# EAGLE design AP==MIGOD (EAGLE 7.3.0)
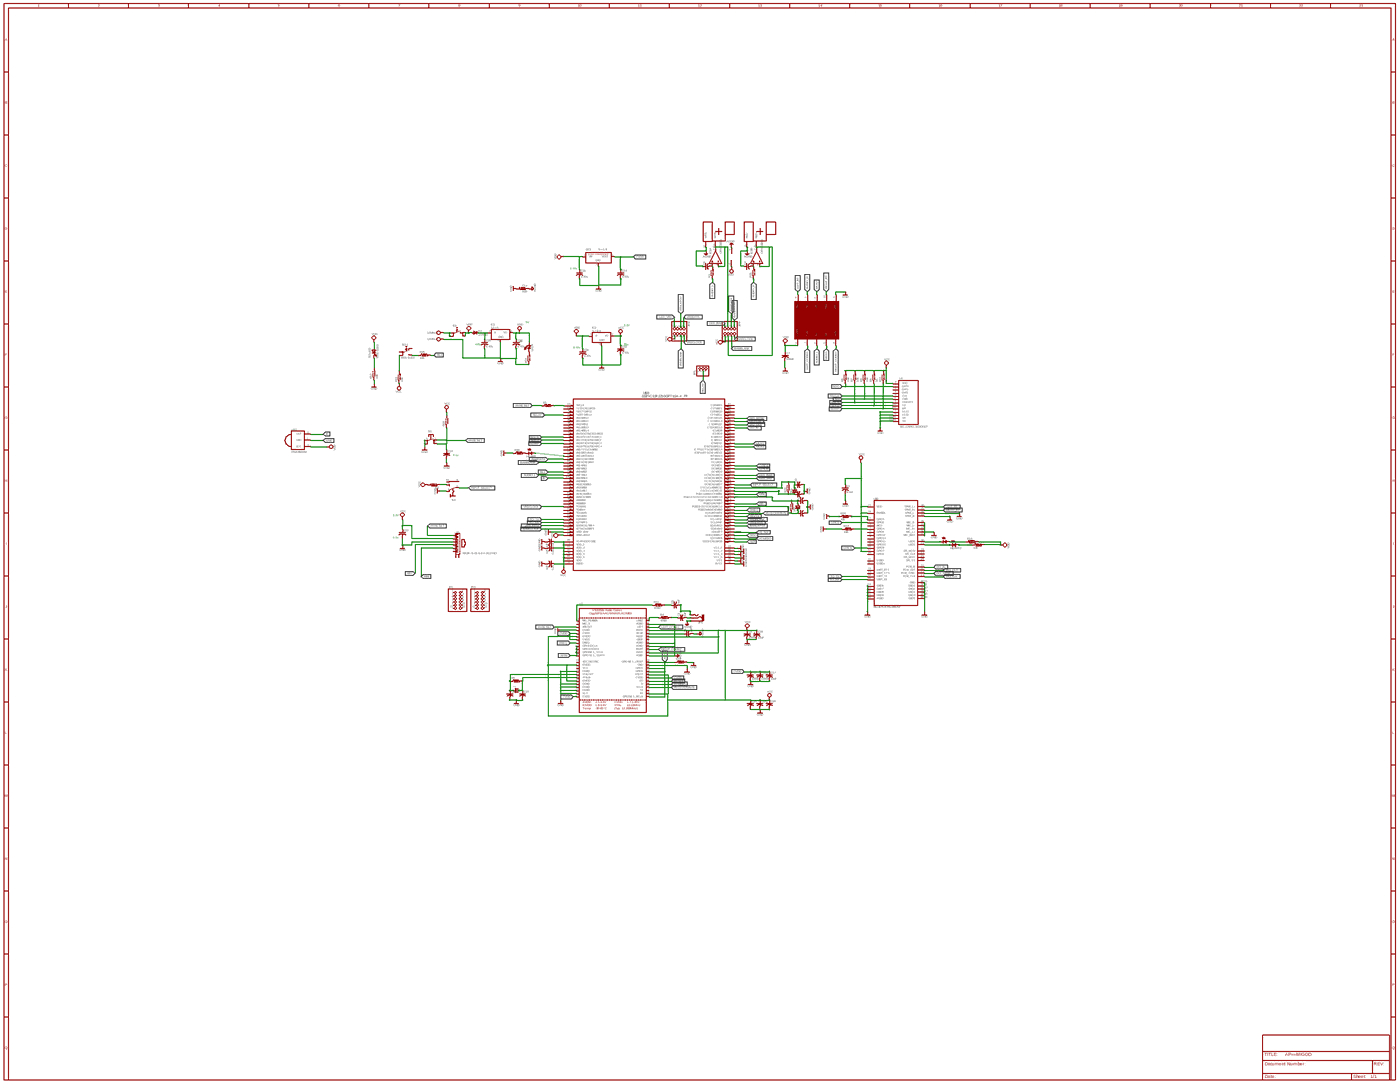
[diagram p0: schematic, sheet 1, overview]
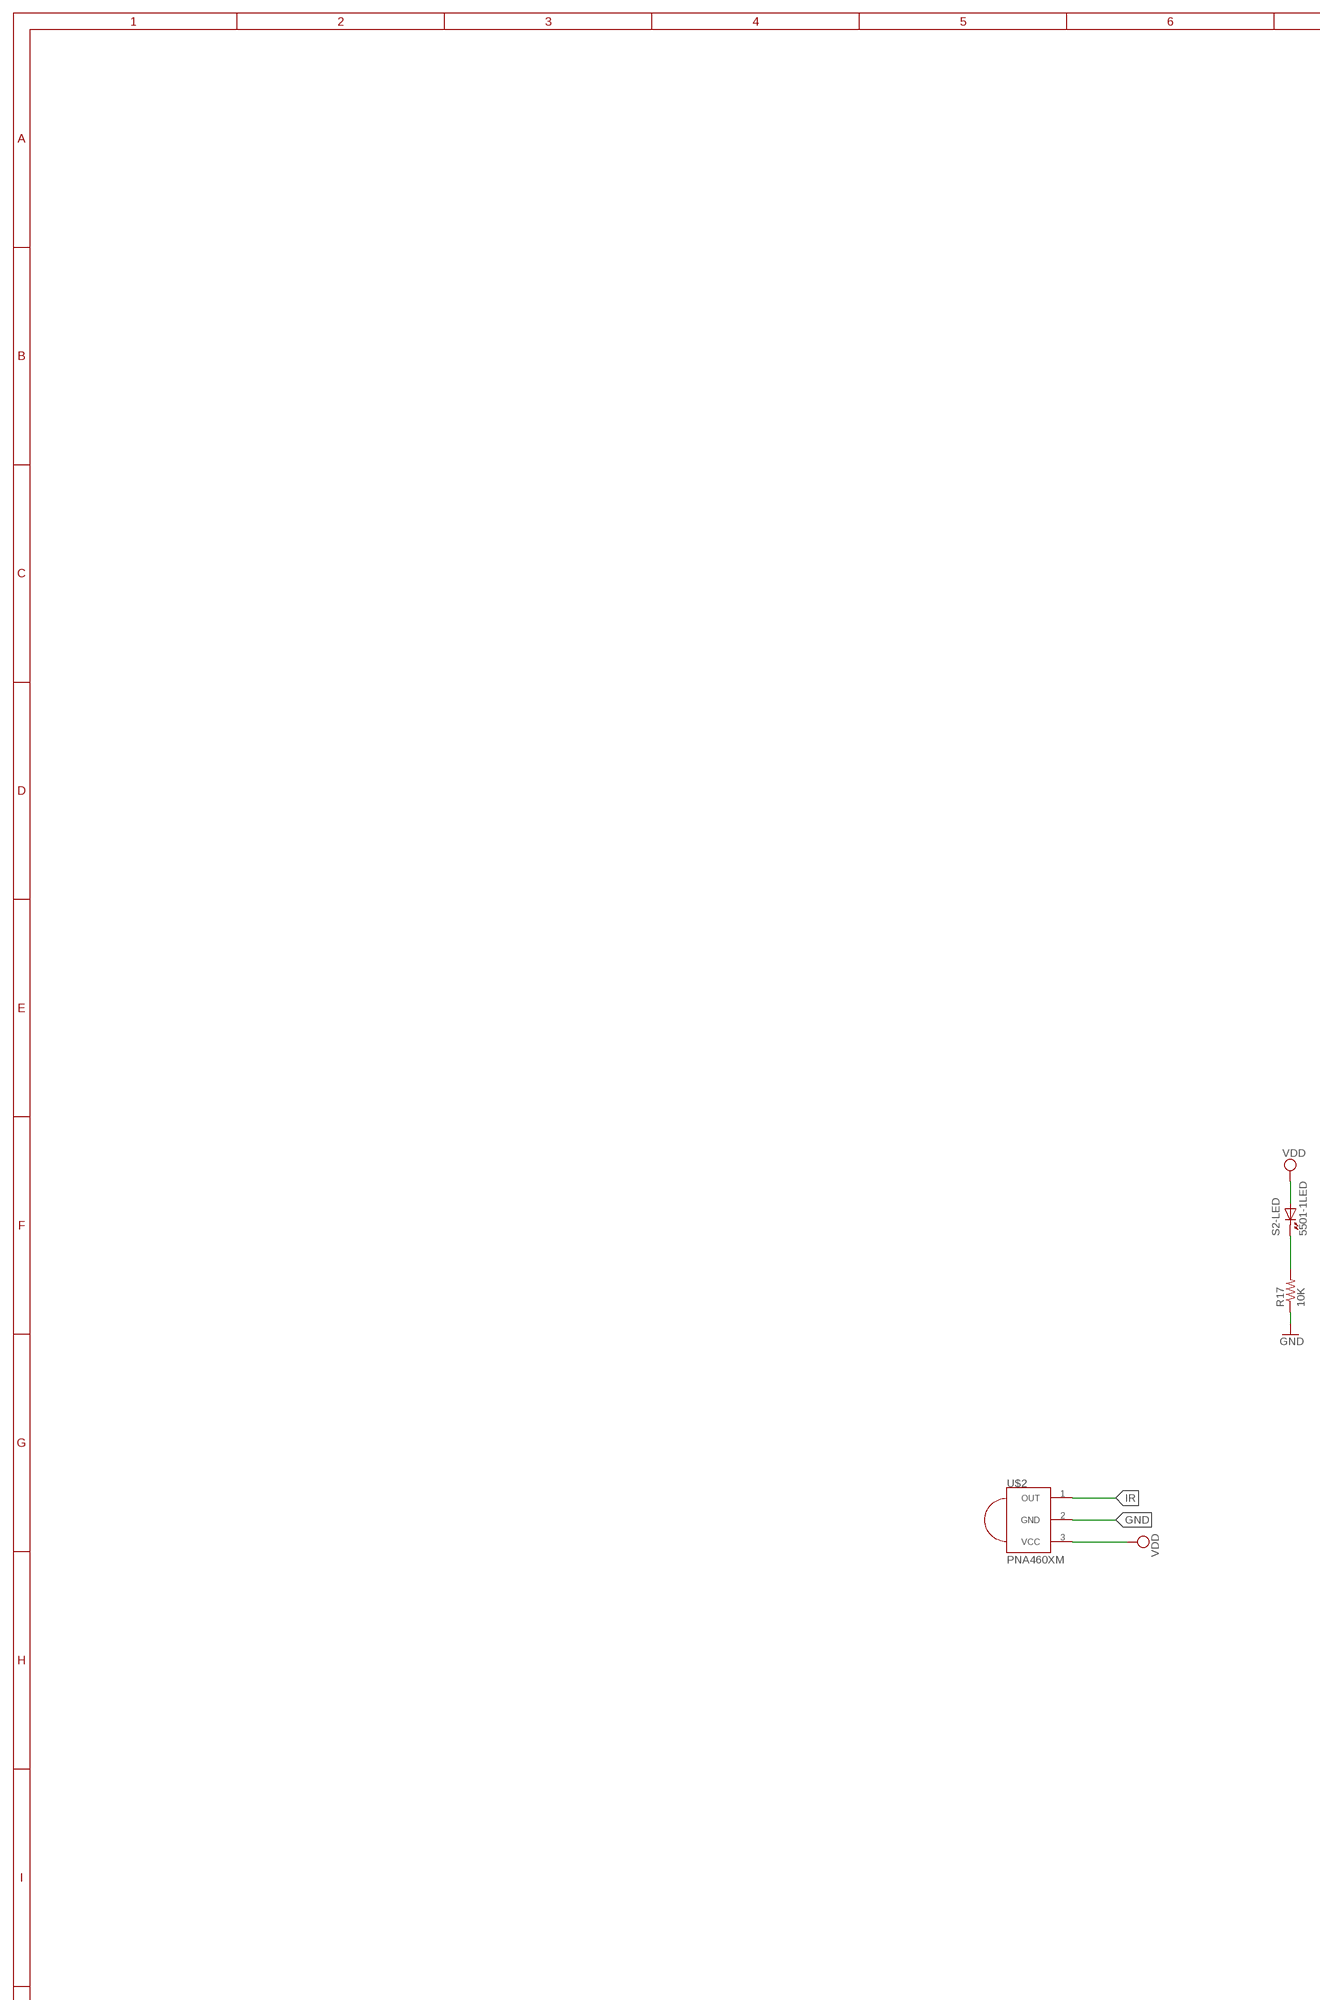
[diagram p1: schematic, sheet 1, part 1 of 6]
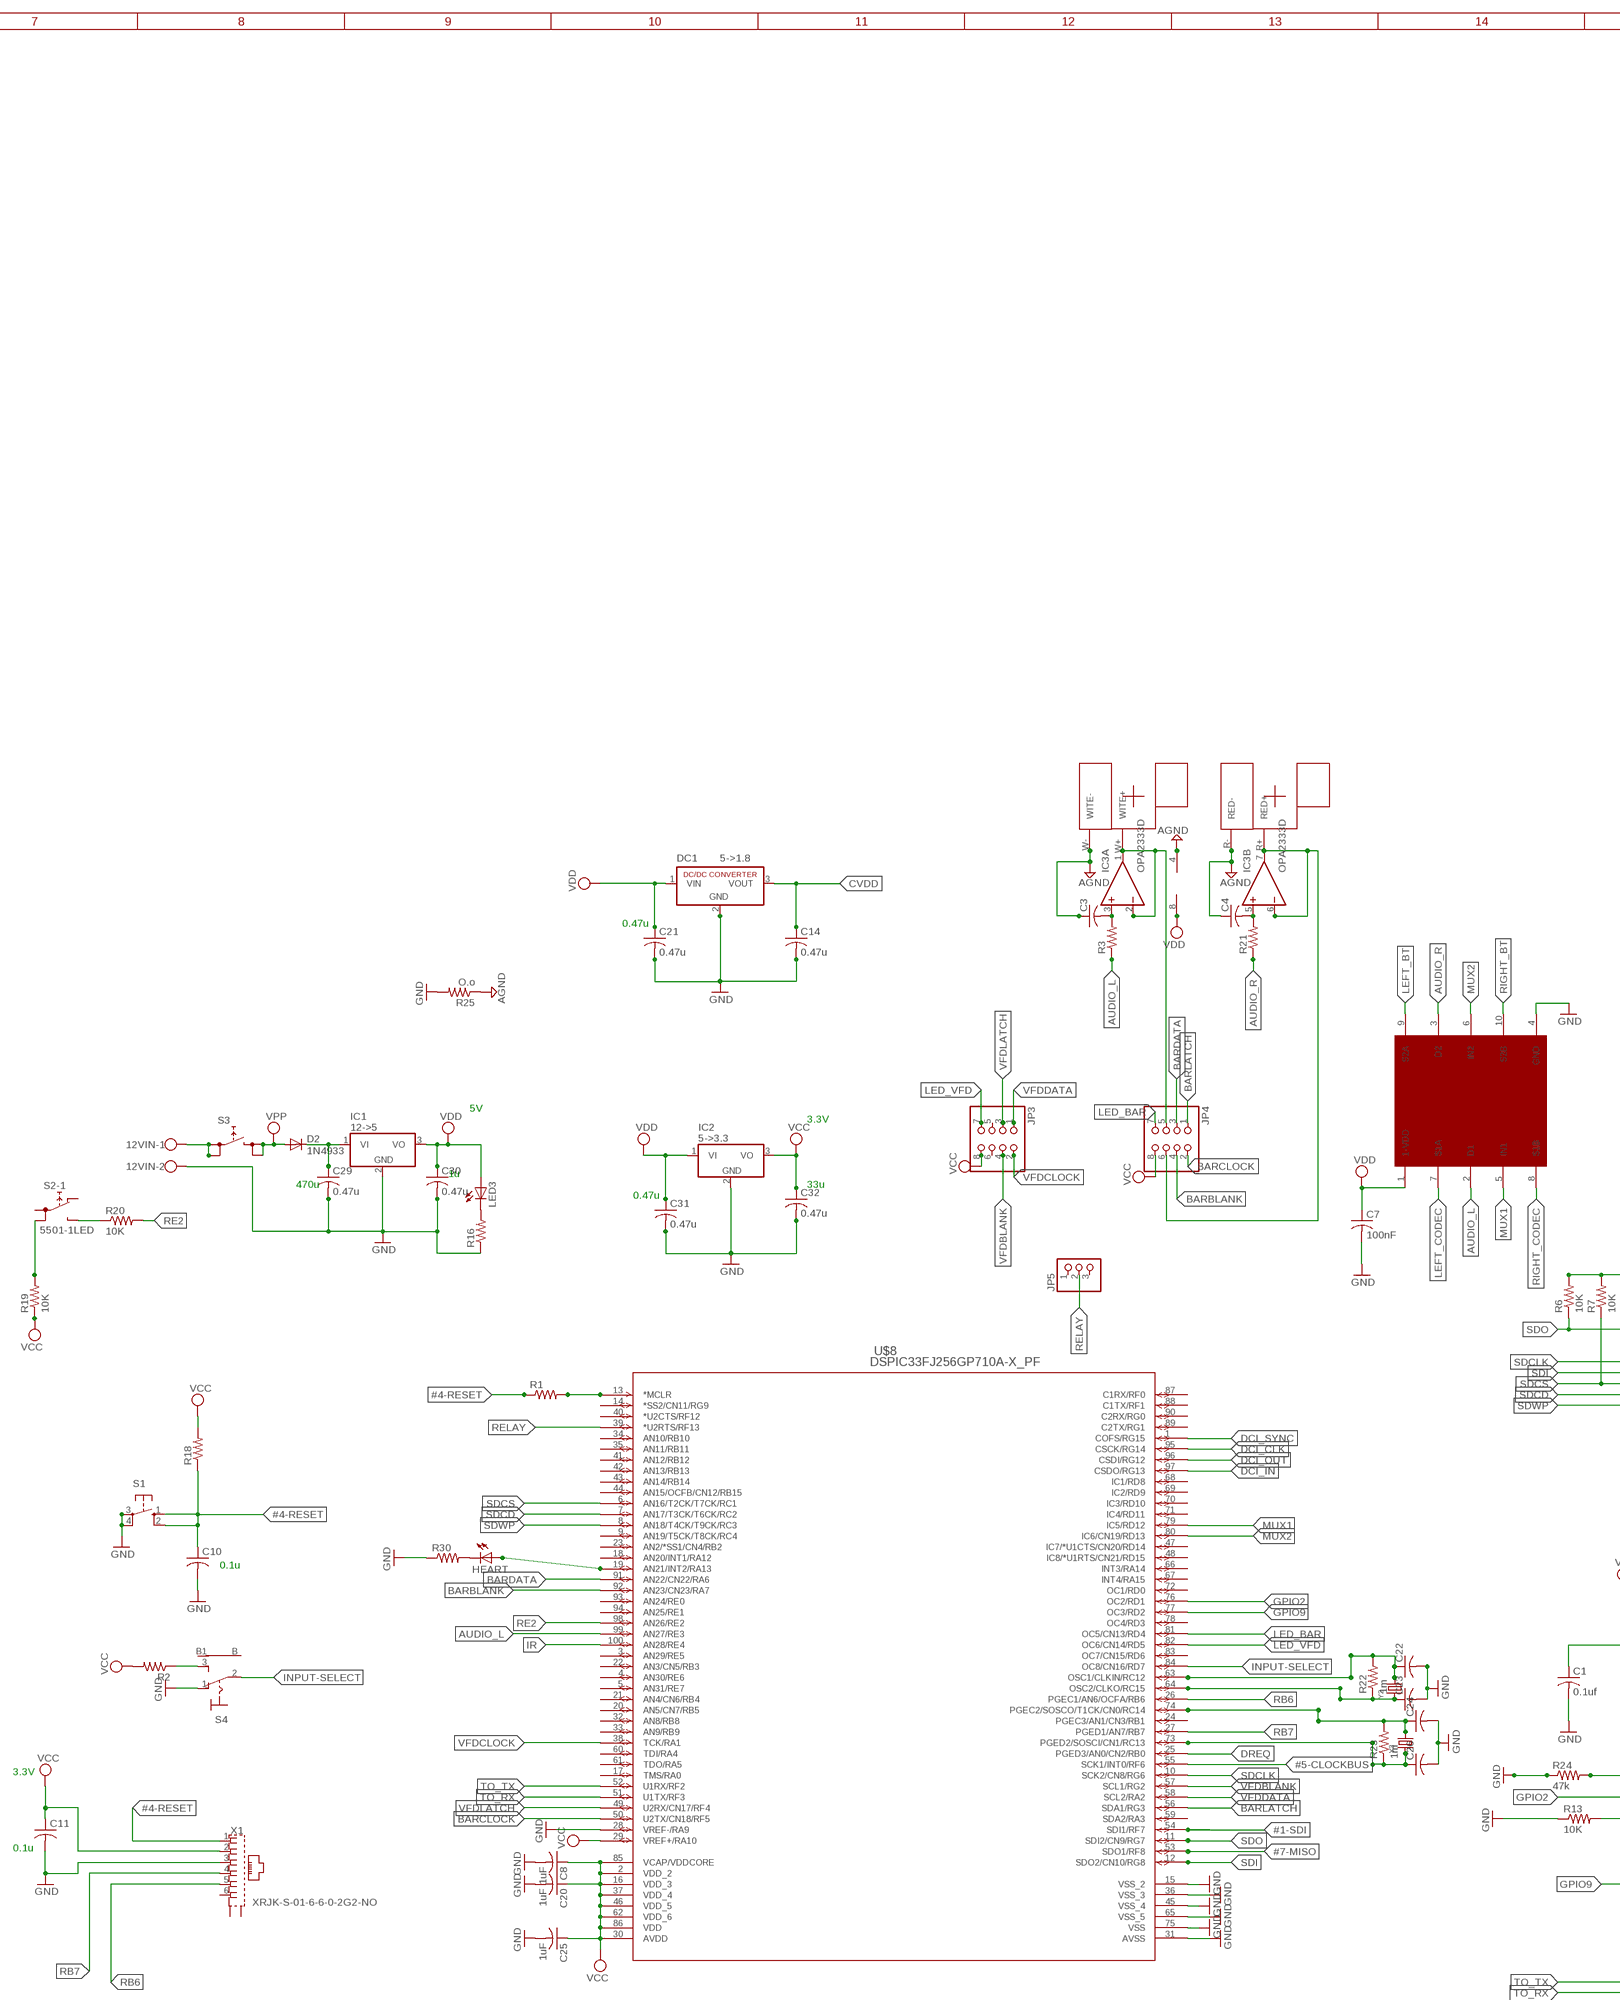
[diagram p2: schematic, sheet 1, part 2 of 6]
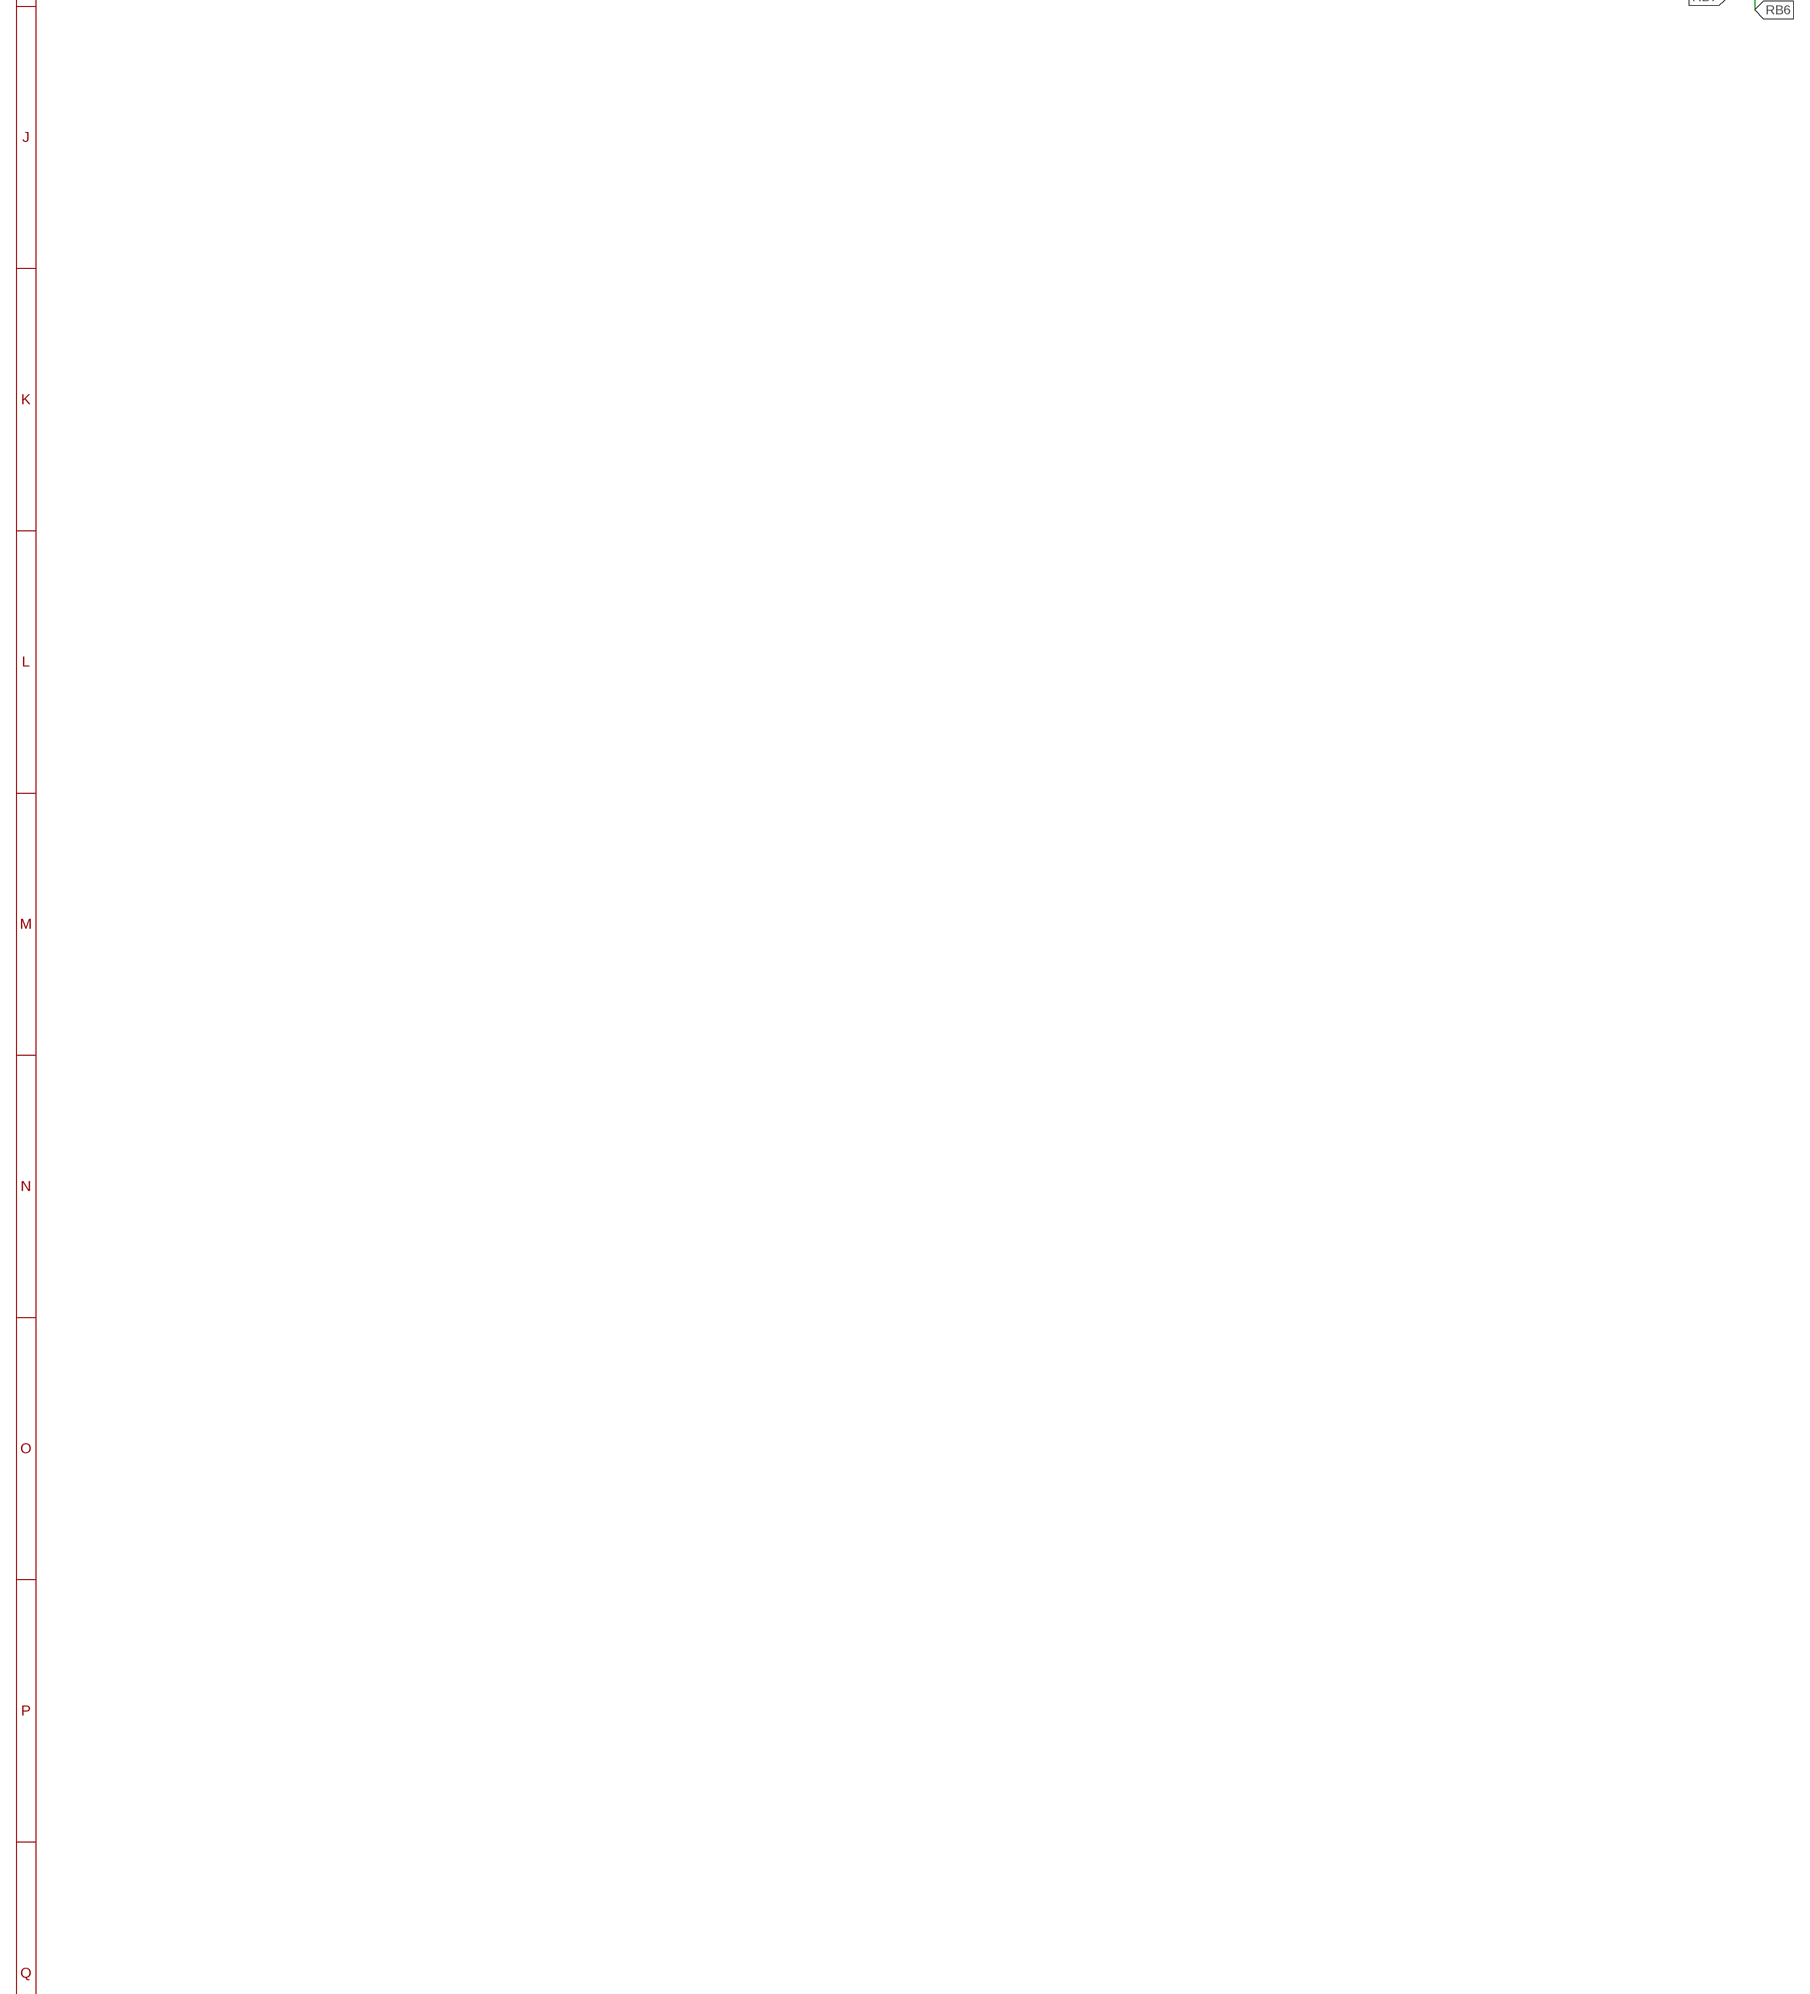
[diagram p3: schematic, sheet 1, part 3 of 6]
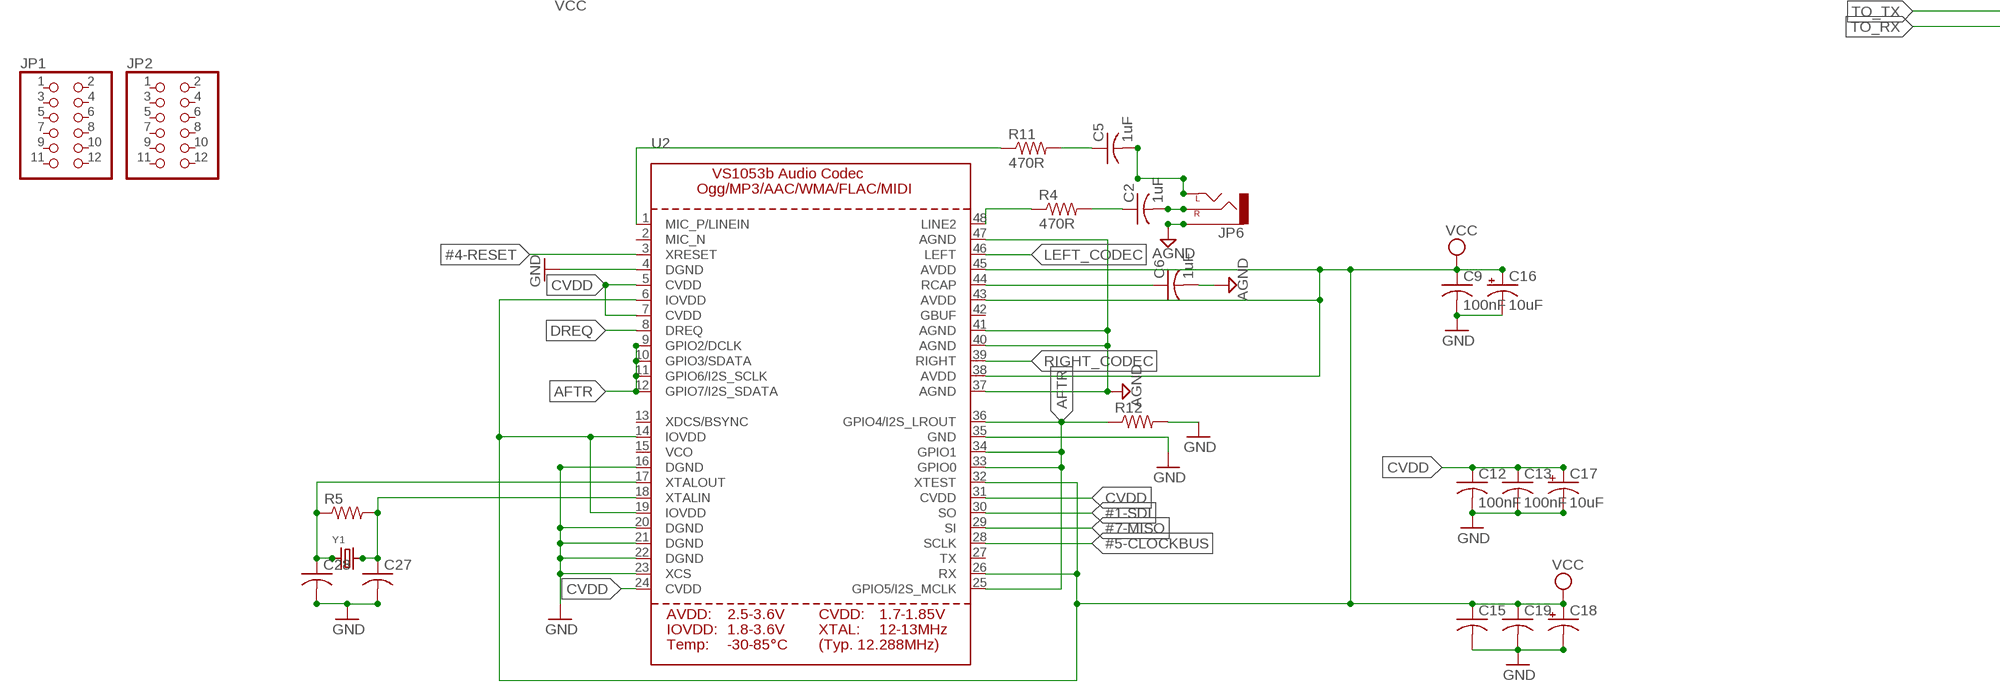
[diagram p4: schematic, sheet 1, part 4 of 6]
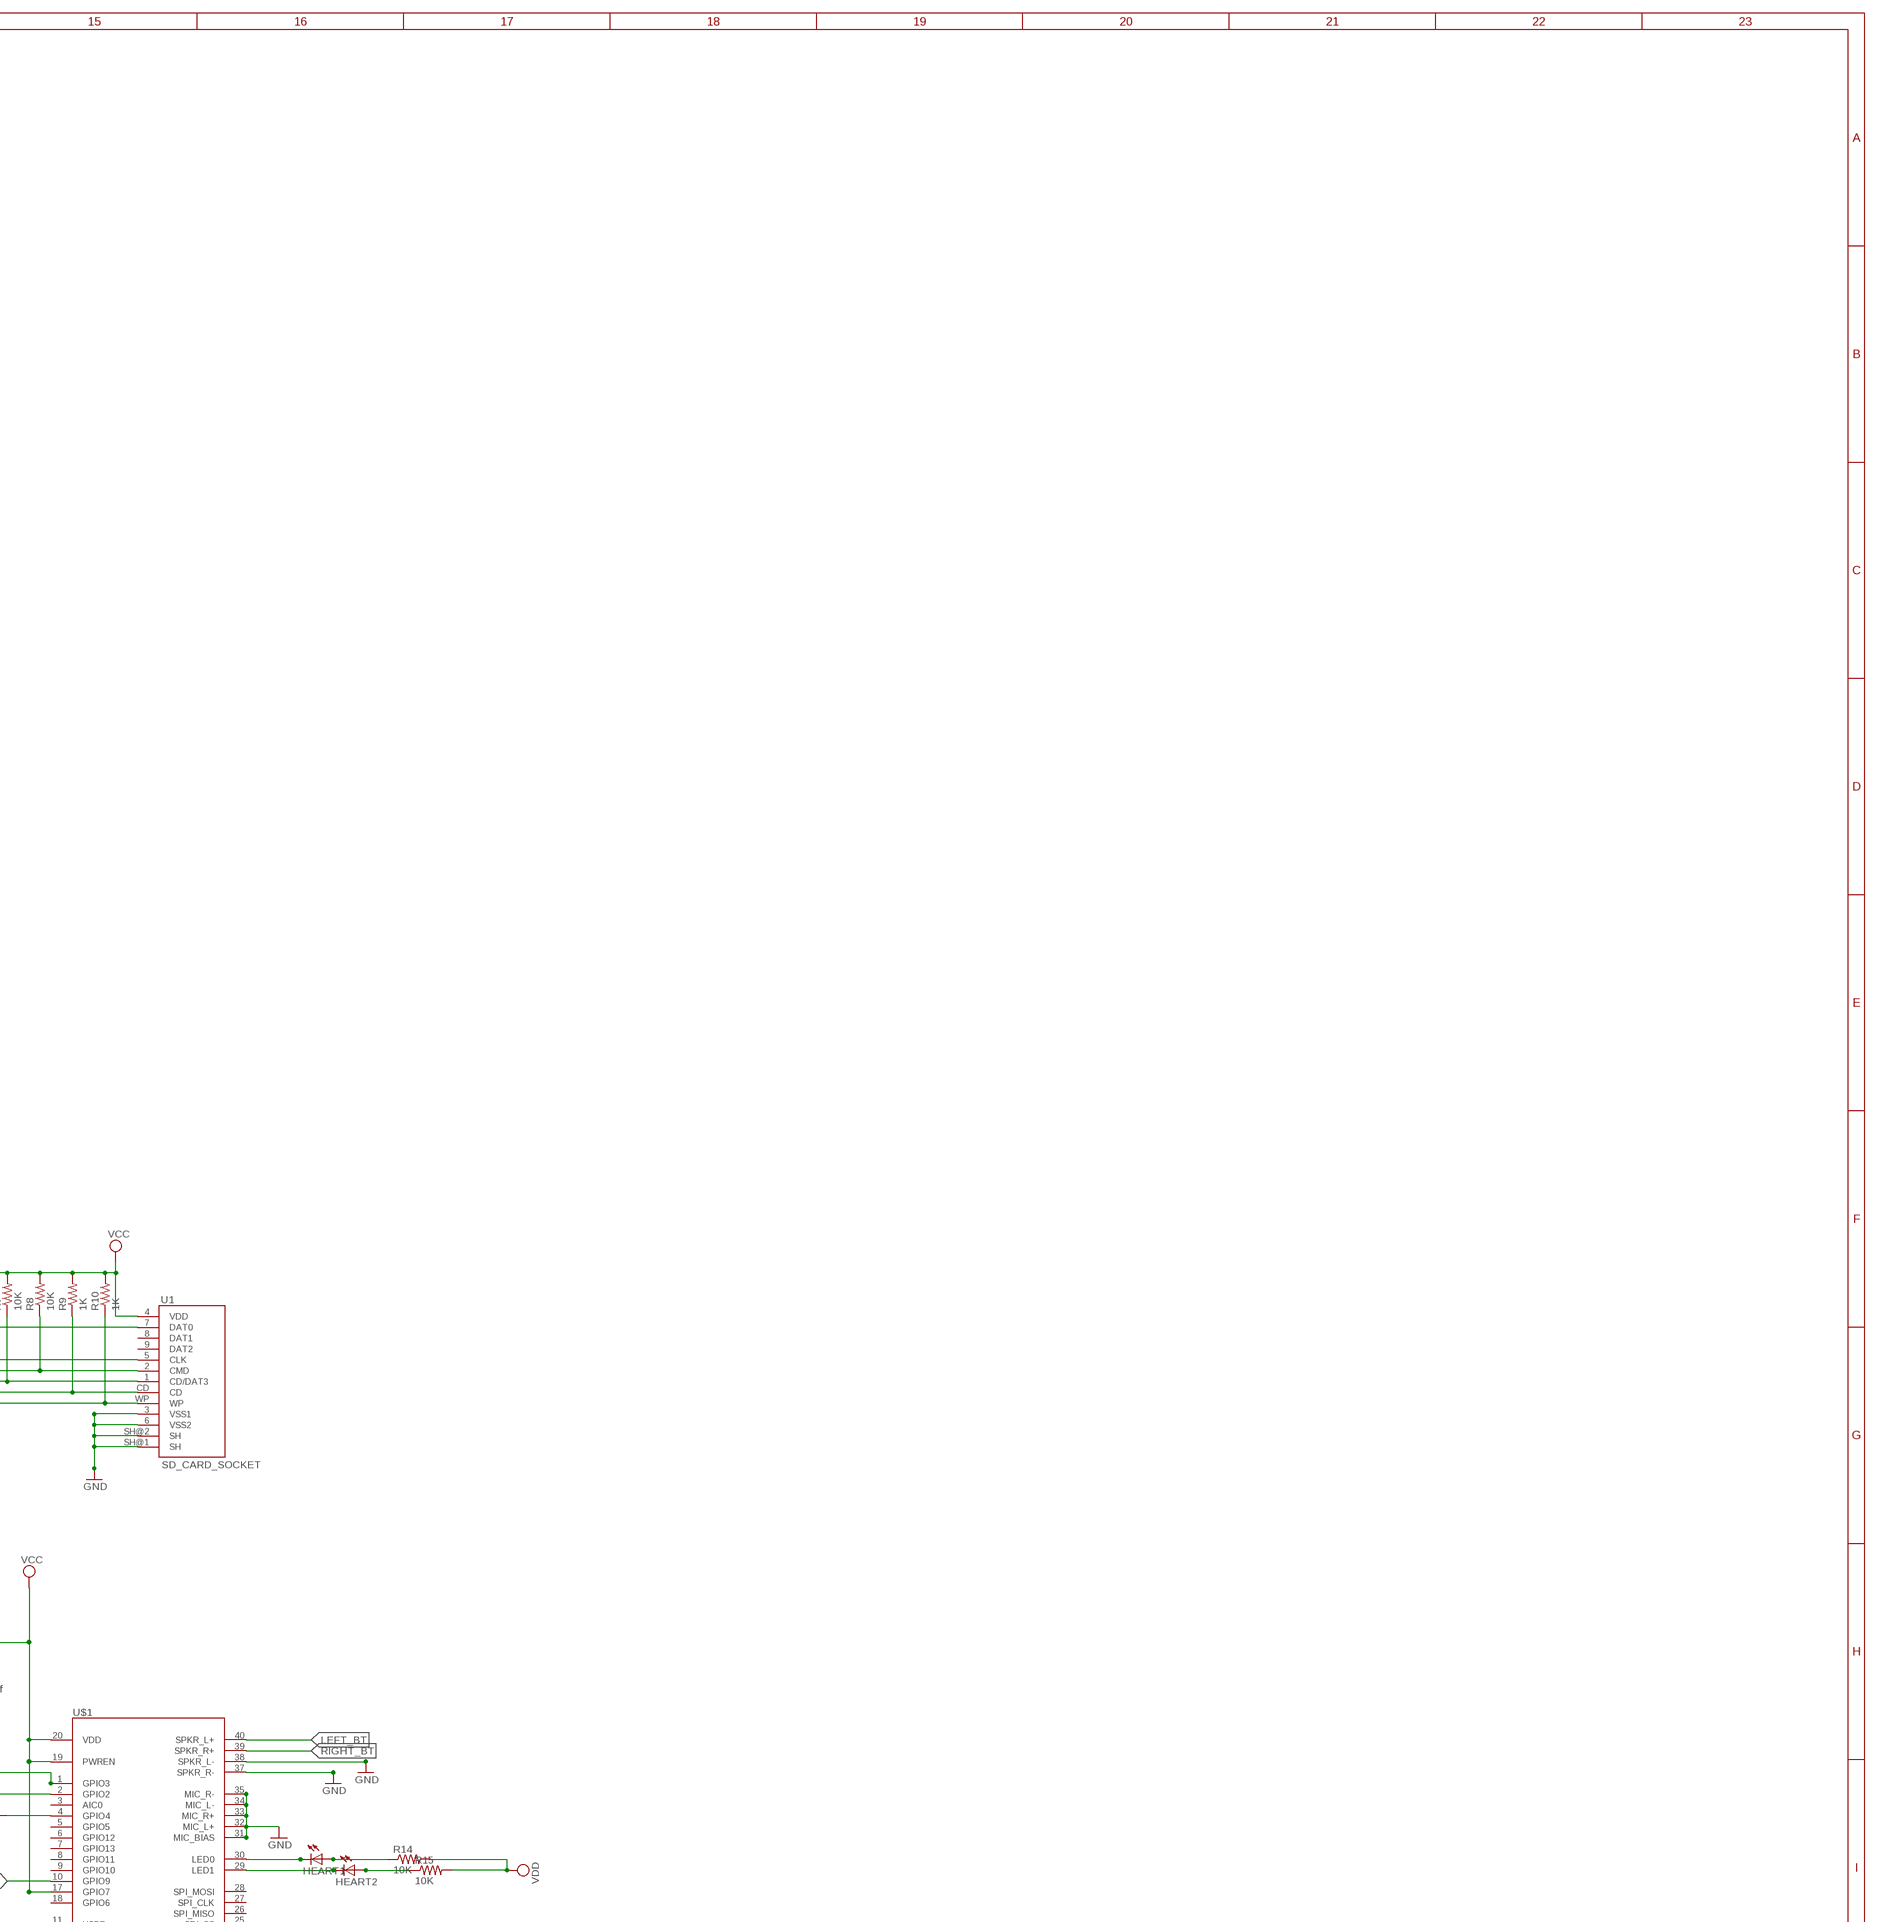
[diagram p5: schematic, sheet 1, part 5 of 6]
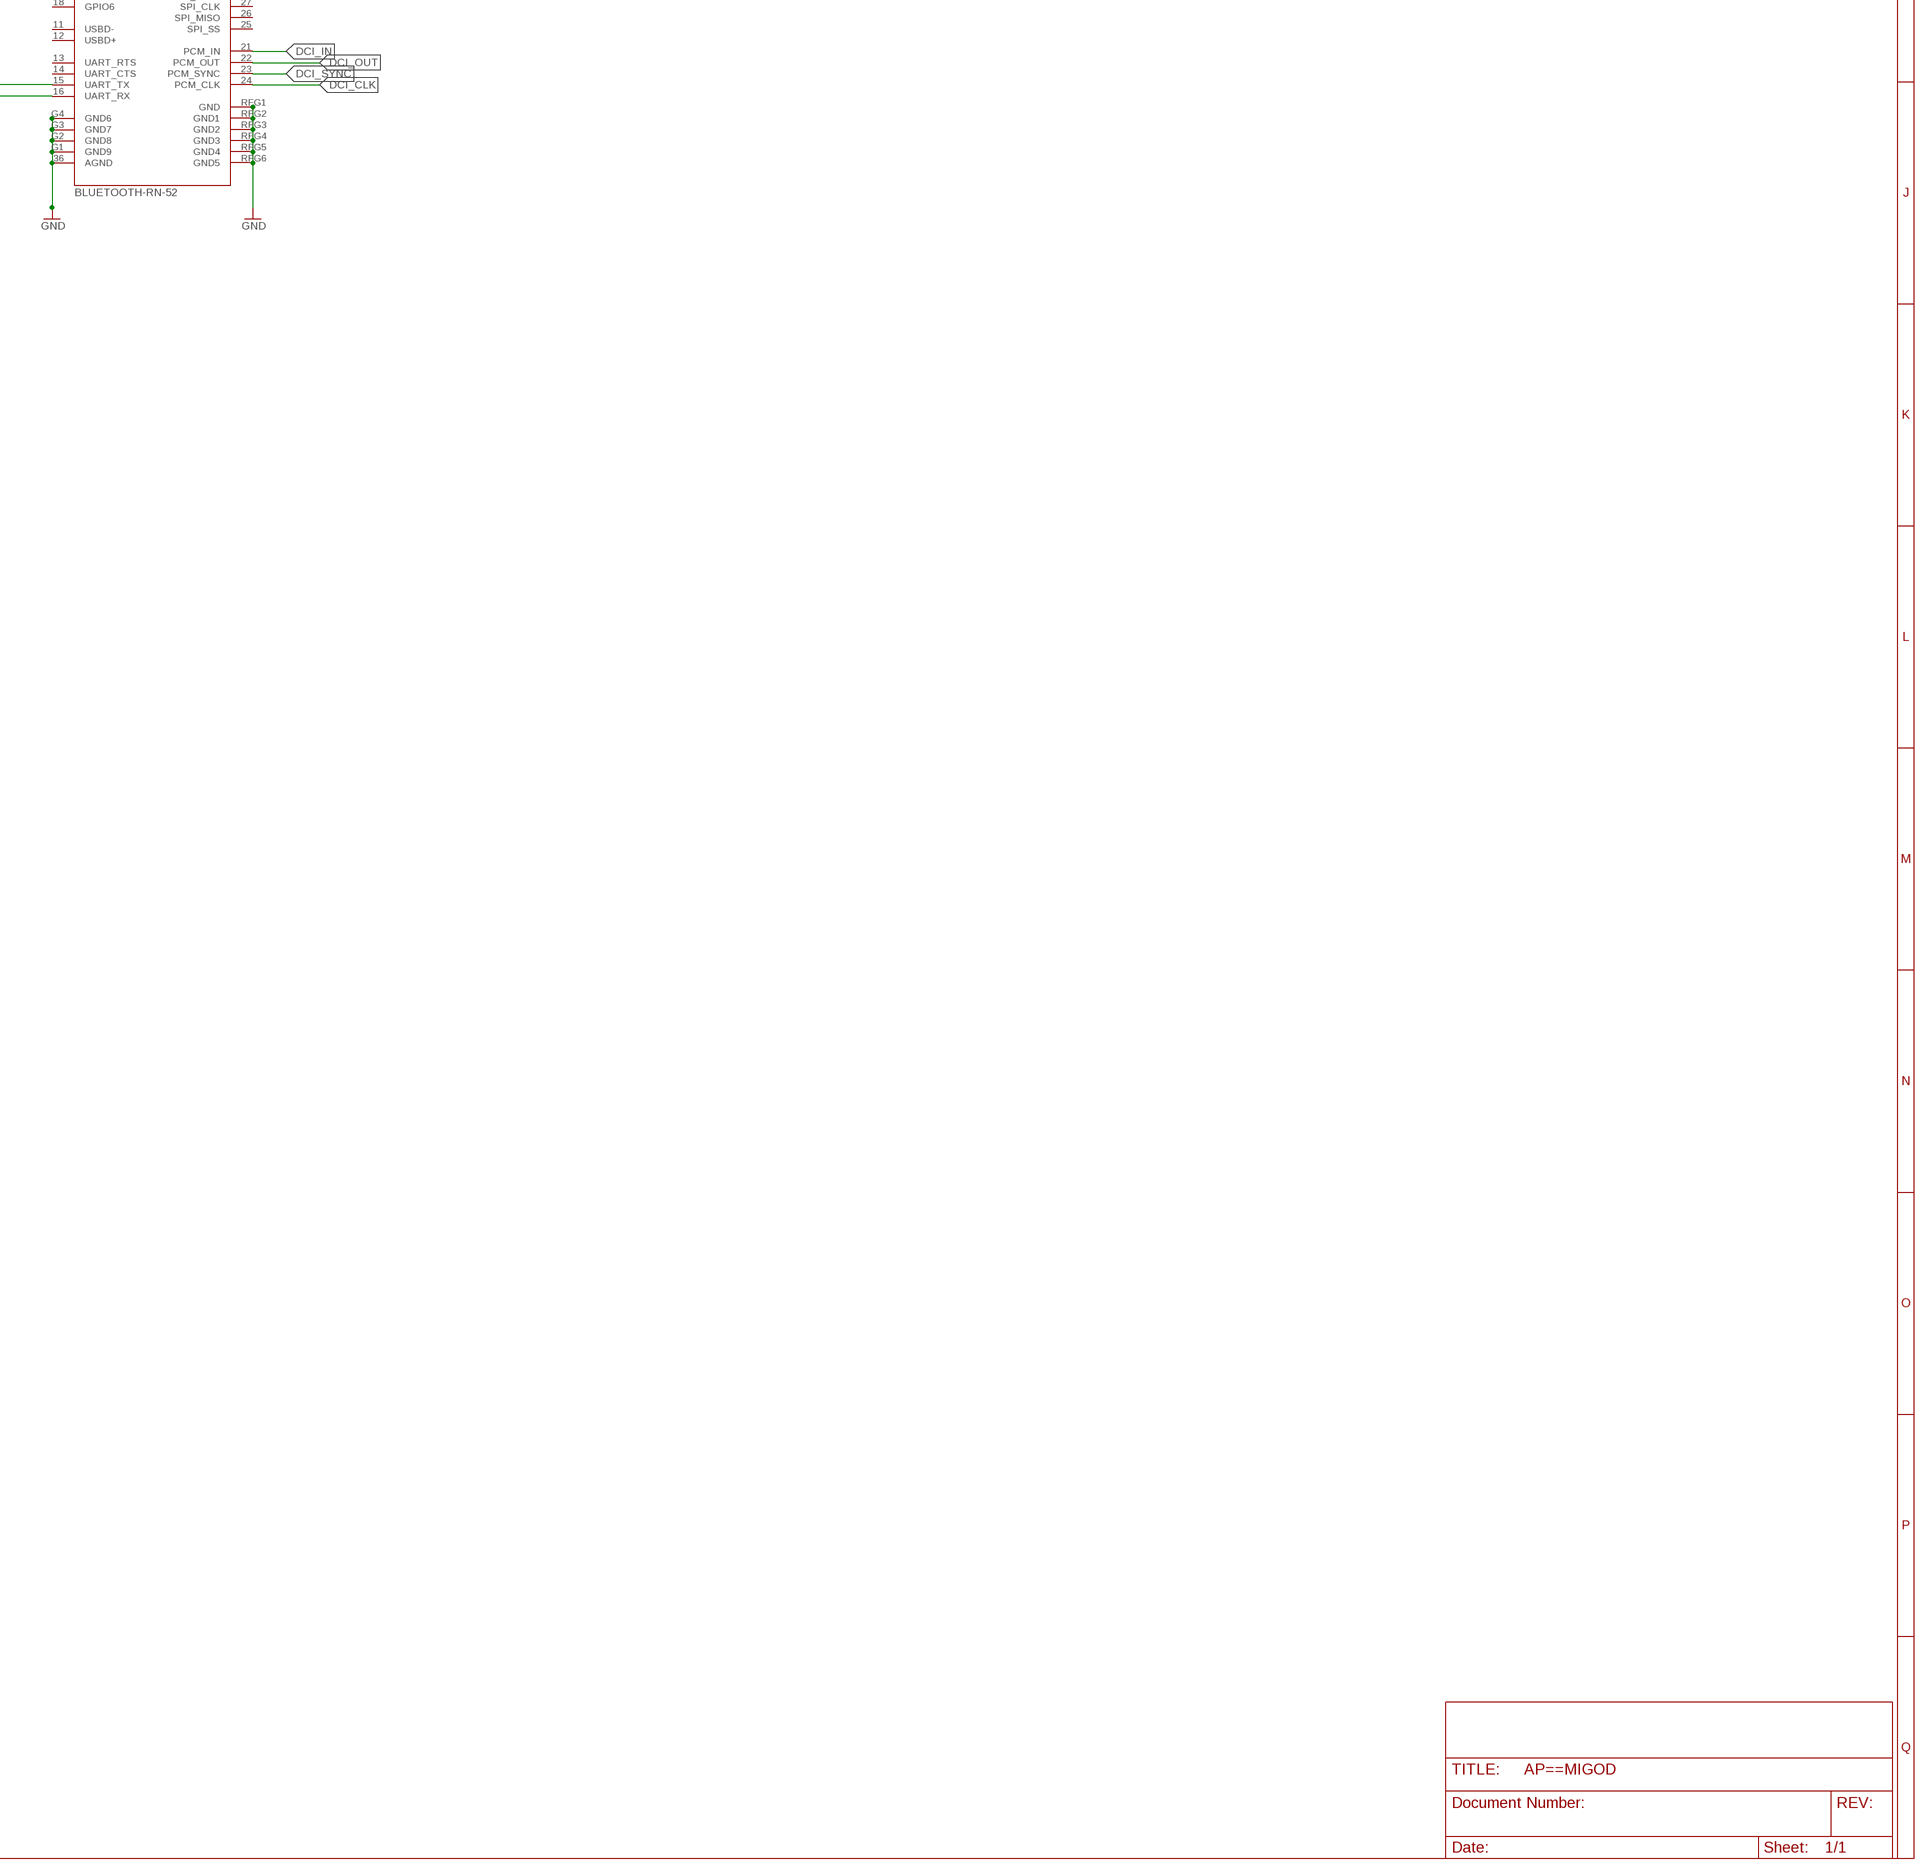
[diagram p6: schematic, sheet 1, part 6 of 6]

## Parts
12VIN  W237-102  [W237-102]
C1  0.1uf  C-USC1206  [C1206]
C2  1uF  C-USC1206  [C1206]
C3  C-US050-030X075  [C050-030X075]
C4  C-US050-030X075  [C050-030X075]
C5  1uF  C-USC1206  [C1206]
C6  1uF  C-USC1206  [C1206]
C7  100nF  C-USC1206  [C1206]
C8  1uF  C-USC1206  [C1206]
C9  100nF  C-USC1206  [C1206]
C10  C-USC1206  [C1206]
C11  C-USC1206  [C1206]
C12  100nF  C-USC1206  [C1206]
C13  100nF  C-USC1206  [C1206]
C14  0.47u  C-USC1206  [C1206]
C15  C-USC1206  [C1206]
C16  10uF  CPOL-USE5-8.5  [E5-8,5]
C17  10uF  CPOL-USE5-8.5  [E5-8,5]
C18  CPOL-USE5-8.5  [E5-8,5]
C19  C-USC1206  [C1206]
C20  1uF  C-USC1206  [C1206]
C21  0.47u  C-USC1206  [C1206]
C22  C-USC1206  [C1206]
C23  C-USC1206  [C1206]
C24  C-USC1206  [C1206]
C25  1uF  C-USC1206  [C1206]
C26  C-USC1206  [C1206]
C27  C-USC1206  [C1206]
C28  C-USC1206  [C1206]
C29  0.47u  C-USC1206  [C1206]
C30  0.47u  C-USC1206  [C1206]
C31  0.47u  C-USC1206  [C1206]
C32  0.47u  C-USC1206  [C1206]
D2  1N4933  [DO41-10]
DC1  5->1.8  R-78C1.8-1.0  [SIP3]
HEART  LEDSMT1206  [1206]
HEART1  LEDSMT1206  [1206]
HEART2  LEDSMT1206  [1206]
IC1  12->5  786TV  [TO220V]
IC2  5->3.3  786TV  [TO220V]
IC3  OPA2333D  [SO08]
JP1  PINHD-2X6  [2X06]
JP2  PINHD-2X6  [2X06]
JP3  PINHD-2X4  [2X04]
JP4  PINHD-2X4  [2X04]
JP5  PINHD-1X3  [1X03]
JP6  AUDIO-JACKPTH  [AUDIO-JACK]
LED3  LEDSMT1206  [1206]
R1  R-US_R1206  [R1206]
R2  R-US_R1206  [R1206]
R3  R-US_0207/10  [0207/10]
R4  470R  R-US_R1206  [R1206]
R5  R-US_R1206  [R1206]
R6  10K  R-US_R1206  [R1206]
R7  10K  R-US_R1206  [R1206]
R8  10K  R-US_R1206  [R1206]
R9  1K  R-US_R1206  [R1206]
R10  1K  R-US_R1206  [R1206]
R11  470R  R-US_R1206  [R1206]
R12  R-US_R1206  [R1206]
R13  10K  R-US_R1206  [R1206]
R14  10K  R-US_R1206  [R1206]
R15  10K  R-US_R1206  [R1206]
R16  R-US_R1206  [R1206]
R17  10K  R-US_R1206  [R1206]
R18  R-US_R1206  [R1206]
R19  10K  R-US_R1206  [R1206]
R20  10K  R-US_R1206  [R1206]
R21  R-US_0207/10  [0207/10]
R22  1m  R-US_R1206  [R1206]
R23  1m  R-US_R1206  [R1206]
R24  47k  R-US_R1206  [R1206]
R25  O.o  R-US_R1206  [R1206]
R30  R-US_R1206  [R1206]
S1  10-XX  [B3F-10XX]
S2  5501-1LED  [5501-1LED]
S3  REKN  [REKN]
S4  9070-1W  [9070-1W]
U1  SD_CARD_SOCKET  [SD_1:1]
U2  VS1053B  [LQFP48]
U$1  BLUETOOTH-RN-52  [RN-52]
U$2  PNA460XM  [PNA460XM]
U$8  DSPIC33FJ256GP710A-X_PF  [TQFP100_14X14MC]
U$13  RCANEW  [RCA]
U$15  ADG884  [MSOP10]
X1  XRJK-S-01-6-6-0-2G2-NO  [XRJK-S-01-6-6-0-2G2-NO]
Y1  CRYSTALTHIN  [CRYSTAL_3.2X2.5]
Y2  CRYSTALTHIN  [CRYSTAL_3.2X2.5]
Y3  CRYSTALTHIN  [CRYSTAL_3.2X2.5]

## Nets
#1-SDI: U2.30(SO) U$8.54(SDI1/RF7)
#4-RESET: C10.1 R1.1 R18.1 S1.1(S) S1.2(S1) U2.3(XRESET) X1.1
#5-CLOCKBUS: U2.28(SCLK) U$8.55(SCK1/INT0/RF6)
#7-MISO: U2.29(SI) U$8.53(SDO1/RF8)
AFTR: R12.1 U2.9(GPIO2/DCLK) U2.10(GPIO3/SDATA) U2.11(GPIO6/I2S_SCLK) U2.12(GPIO7/I2S_SDATA) U2.25(GPIO5/I2S_MCLK) U2.33(GPIO0) U2.34(GPIO1) U2.36(GPIO4/I2S_LROUT)
AGND: C3.1 C4.1 C6.2 IC3.4(P:V-) JP6.SLEEVE R25.1 U2.37(AGND) U2.40(AGND) U2.41(AGND) U2.47(AGND) U$13.R-(RED-) U$13.W-(WITE-)
AUDIO_L: R3.1 U$8.99(AN27/RE3) U$15.2(D1)
AUDIO_R: R21.1 U$15.3(D2)
BARBLANK: JP4.4 U$8.92(AN23/CN23/RA7)
BARCLOCK: JP4.2 U$8.50(U2TX/CN18/RF5)
BARDATA: JP4.3 U$8.91(AN22/CN22/RA6)
BARLATCH: JP4.1 U$8.56(SDA1/RG3)
CVDD: C12.1 C13.1 C14.1 C17.+ DC1.3(VOUT) U2.5(CVDD) U2.7(CVDD) U2.24(CVDD) U2.31(CVDD)
DCI_CLK: U$1.24(PCM_CLK) U$8.95(CSCK/RG14)
DCI_IN: U$1.21(PCM_IN) U$8.97(CSDO/RG13)
DCI_OUT: U$1.22(PCM_OUT) U$8.96(CSDI/RG12)
DCI_SYNC: U$1.23(PCM_SYNC) U$8.1(COFS/RG15)
DREQ: U2.8(DREQ) U$8.25(PGED3/AN0/CN2/RB0)
GND: 12VIN.2 C1.2 C7.2 C8.2 C9.2 C10.2 C11.2 C12.2 C13.2 C14.2 C15.2 C16.- C17.- C18.- C19.2 C20.2 C21.2 C22.2 C23.2 C24.2 C25.2 C26.2 C27.2 C28.2 C29.2 C30.2 C31.2 C32.2 DC1.2(GND) IC1.2(GND) IC2.2(GND) R12.2 R13.1 R16.1 R17.1 R24.1 R25.2 R30.1 S1.3(P) S1.4(P1) S4.1(O) U1.3(VSS1) U1.6(VSS2) U1.SH@1(SH) U1.SH@2(SH) U2.4(DGND) U2.16(DGND) U2.20(DGND) U2.21(DGND) U2.22(DGND) U2.23(XCS) U2.35(GND) U$1.31(MIC_BIAS) U$1.32(MIC_L+) U$1.33(MIC_R+) U$1.34(MIC_L-) U$1.35(MIC_R-) U$1.36(AGND) U$1.37(SPKR_R-) U$1.38(SPKR_L-) U$1.G1(GND9) U$1.G2(GND8) U$1.G3(GND7) U$1.G4(GND6) U$1.RFG1(GND) U$1.RFG2(GND1) U$1.RFG3(GND2) U$1.RFG4(GND3) U$1.RFG5(GND4) U$1.RFG6(GND5) U$2.2(GND) U$8.15(VSS_2) U$8.28(VREF-/RA9) U$8.31(AVSS) U$8.36(VSS_3) U$8.45(VSS_4) U$8.65(VSS_5) U$8.75(VSS) U$15.4(GND) X1.3
GPIO2: U$1.2(GPIO2) U$8.76(OC2/RD1)
GPIO9: U$1.10(GPIO9) U$8.77(OC3/RD2)
INPUT-SELECT: S4.2(P) U$8.84(OC8/CN16/RD7)
IR: U$2.1(OUT) U$8.100(AN28/RE4)
LED_BAR: JP4.7 U$8.81(OC5/CN13/RD4)
LED_VFD: JP3.7 U$8.82(OC6/CN14/RD5)
LEFT_BT: U$1.40(SPKR_L+) U$15.9(S2A)
LEFT_CODEC: U2.46(LEFT) U$15.7(S1A)
MUX1: U$8.79(IC5/RD12) U$15.5(IN1)
MUX2: U$8.80(IC6/CN19/RD13) U$15.6(IN2)
N$1: C2.2 JP6.RING(RIGHT)
N$2: R1.2 U$8.13(*MCLR)
N$3: LED3.C R16.2
N$4: C6.1 U2.44(RCAP)
N$5: R19.2 S2.1B(-1:1B)
N$9: C28.1 R5.1 U2.17(XTALOUT) Y1.1
N$12: C27.1 R5.2 U2.18(XTALIN) Y1.2
N$13: C2.1 R4.2
N$14: R4.1 U2.48(LINE2)
N$15: C5.2 JP6.TIP(LEFT)
N$16: C5.1 R11.2
N$17: R11.1 U2.1(MIC_P/LINEIN)
N$19: C24.1 R23.2 U$8.74(PGEC2/SOSCO/T1CK/CN0/RC14) Y3.2
N$20: R13.2 U$1.4(GPIO4)
N$22: C29.1 D2.C IC1.1(VI)
N$23: HEART1.C U$1.30(LED0)
N$24: HEART2.C U$1.29(LED1)
N$25: HEART1.A R14.1
N$26: HEART2.A R15.1
N$27: C22.1 R22.2 U$8.63(OSC1/CLKIN/RC12) Y2.2
N$28: IC3.1(A:OUT) IC3.2(A:-IN) JP4.5 U$13.W+(WITE+)
N$29: IC3.6(B:-IN) IC3.7(B:OUT) JP4.6 U$13.R+(RED+)
N$30: C3.2 IC3.3(A:+IN) R3.2
N$31: R17.2 S2.-(-LED:K)
N$32: R20.1 S2.NO(-1:NO)
N$33: 12VIN.1 S3.0A S3.0B
N$34: C4.2 IC3.5(B:+IN) R21.2
N$35: R2.1 S4.3(S)
N$36: R24.2 U$1.1(GPIO3)
N$37: C23.1 R22.1 U$8.64(OSC2/CLKO/RC15) Y2.1
N$78: C26.1 R23.1 U$8.73(PGED2/SOSCI/CN1/RC13) Y3.1
N$97: HEART.A U$8.19(AN21/INT2/RA13)
N$98: HEART.C R30.2
RB6: U$8.26(PGEC1/AN6/OCFA/RB6) X1.5
RB7: U$8.27(PGED1/AN7/RB7) X1.4
RE2: R20.2 U$8.98(AN26/RE2)
RELAY: JP5.2 U$8.39(*U2RTS/RF13)
RIGHT_BT: U$1.39(SPKR_R+) U$15.10(S2B)
RIGHT_CODEC: U2.39(RIGHT) U$15.8(S1B)
SDCD: R9.1 U1.CD U$8.7(AN17/T3CK/T6CK/RC2)
SDCLK: U1.5(CLK) U$8.10(SCK2/CN8/RG6)
SDCS: R7.1 U1.1(CD/DAT3) U$8.6(AN16/T2CK/T7CK/RC1)
SDI: R8.1 U1.2(CMD) U$8.12(SDO2/CN10/RG8)
SDO: R6.1 U1.7(DAT0) U$8.11(SDI2/CN9/RG7)
SDWP: R10.1 U1.WP U$8.8(AN18/T4CK/T9CK/RC3)
TO_RX: U$1.16(UART_RX) U$8.51(U1TX/RF3)
TO_TX: U$1.15(UART_TX) U$8.52(U1RX/RF2)
VCC: C1.1 C8.1 C9.1 C11.1 C15.1 C16.+ C18.+ C19.1 C20.1 C25.1 C32.1 IC2.3(VO) JP3.8 JP4.8 R2.2 R6.2 R7.2 R8.2 R9.2 R10.2 R18.2 R19.1 U1.4(VDD) U2.6(IOVDD) U2.14(IOVDD) U2.19(IOVDD) U2.26(RX) U2.32(XTEST) U2.38(AVDD) U2.43(AVDD) U2.45(AVDD) U$1.17(GPIO7) U$1.19(PWREN) U$1.20(VDD) U$8.2(VDD_2) U$8.16(VDD_3) U$8.29(VREF+/RA10) U$8.30(AVDD) U$8.37(VDD_4) U$8.46(VDD_5) U$8.62(VDD_6) U$8.85(VCAP/VDDCORE) U$8.86(VDD) X1.2
VDD: C7.1 C21.1 C30.1 C31.1 DC1.1(VIN) IC1.3(VO) IC2.1(VI) IC3.8(P:V+) LED3.A R14.2 R15.2 S2.+(-LED:A) U$2.3(VCC) U$15.1(1-VDD)
VFDBLANK: JP3.4 U$8.57(SCL1/RG2)
VFDCLOCK: JP3.2 U$8.38(TCK/RA1)
VFDDATA: JP3.1 U$8.58(SCL2/RA2)
VFDLATCH: JP3.3 U$8.49(U2RX/CN17/RF4)
VPP: D2.A S3.1A S3.1B
Unconnected: JP1.1 JP1.2 JP1.3 JP1.4 JP1.5 JP1.6 JP1.7 JP1.8 JP1.9 JP1.10 JP1.11 JP1.12 JP2.1 JP2.2 JP2.3 JP2.4 JP2.5 JP2.6 JP2.7 JP2.8 JP2.9 JP2.10 JP2.11 JP2.12 JP3.5 JP3.6 JP5.1 JP5.3 S2.1A(-1:1A) S2.NC(-1:NC) S4.B S4.B1 U1.8(DAT1) U1.9(DAT2) U2.2(MIC_N) U2.13(XDCS/BSYNC) U2.15(VCO) U2.27(TX) U2.42(GBUF) U$1.3(AIC0) U$1.5(GPIO5) U$1.6(GPIO12) U$1.7(GPIO13) U$1.8(GPIO11) U$1.9(GPIO10) U$1.11(USBD-) U$1.12(USBD+) U$1.13(UART_RTS) U$1.14(UART_CTS) U$1.18(GPIO6) U$1.25(SPI_SS) U$1.26(SPI_MISO) U$1.27(SPI_CLK) U$1.28(SPI_MOSI) U$8.3(AN29/RE5) U$8.4(AN30/RE6) U$8.5(AN31/RE7) U$8.9(AN19/T5CK/T8CK/RC4) U$8.14(*SS2/CN11/RG9) U$8.17(TMS/RA0) U$8.18(AN20/INT1/RA12) U$8.20(AN5/CN7/RB5) U$8.21(AN4/CN6/RB4) U$8.22(AN3/CN5/RB3) U$8.23(AN2/*SS1/CN4/RB2) U$8.24(PGEC3/AN1/CN3/RB1) U$8.32(AN8/RB8) U$8.33(AN9/RB9) U$8.34(AN10/RB10) U$8.35(AN11/RB11) U$8.40(*U2CTS/RF12) U$8.41(AN12/RB12) U$8.42(AN13/RB13) U$8.43(AN14/RB14) U$8.44(AN15/OCFB/CN12/RB15) U$8.47(IC7/*U1CTS/CN20/RD14) U$8.48(IC8/*U1RTS/CN21/RD15) U$8.59(SDA2/RA3) U$8.60(TDI/RA4) U$8.61(TDO/RA5) U$8.66(INT3/RA14) U$8.67(INT4/RA15) U$8.68(IC1/RD8) U$8.69(IC2/RD9) U$8.70(IC3/RD10) U$8.71(IC4/RD11) U$8.72(OC1/RD0) U$8.78(OC4/RD3) U$8.83(OC7/CN15/RD6) U$8.87(C1RX/RF0) U$8.88(C1TX/RF1) U$8.89(C2TX/RG1) U$8.90(C2RX/RG0) U$8.93(AN24/RE0) U$8.94(AN25/RE1) X1.6 X1.S1(S) X1.S2(S)

## Notes on the sheet
- 0.47u
- 5V
- 3.3V
- 1u
- 470u | 33u
- 0.47u
- 0.1u
- 3.3V
- 0.1u

## Library data of the parts
12VIN = con-wago-500:W237-102: WAGO SCREW CLAMP; MPN: 237-102; OC_FARNELL: unknown; OC_NEWARK: 70K9898
C1-C9 C12-C15 C19-C32 = rcl:C-US: CAPACITOR, American symbol
C10 C11 = resistor:C-US: CAPACITOR, American symbol
C16-C18 = rcl:CPOL-US: POLARIZED CAPACITOR, American symbol
D2 = diode:1N4933: DIODE fast recovery rectifier, 1A
DC1 = dc-dc-converter:R-78C*-1.0: INNOLINE DC/DC-Converter 1.0 AMP SIP3 Single Output Source: Data sheet <http://www.mikrocontroller.net/attachment/150645/157764-da-01-en-DC_DC_WANDLER_R_78C5_0_1_0.pdf>
HEART HEART1 HEART2 LED3 = adafruit:LED: LED OSRAM: - CHIPLED LG R971, LG N971, LY N971, LG Q971, LY Q971, LO R971, LY R971 LH N974, LH R974 LS Q976, LO Q976, LY Q976 LO Q996 - Hyper CHIPLED LW Q18S LB Q993, LB Q99A, LB R99A - SideLED LS A670, LO A670, LY A670, LG A670, LP A670 LB A673, LV A673, LT A673, LW A673 LH A674 LY A675 LS A676, LA A676, LO A676, LY A676, LW A676 LS A679, LY A679, LG A679 - Hyper Micro SIDELED® LS Y876, LA Y876, LO Y876, LY Y876 LT Y87S - SmartLED LW L88C, LW L88S LB L89C, LB L89S, LG L890 LS L89K, LO L89K, LY L89K LS L896, LA L896, LO L896, LY L896 - TOPLED LS T670, LO T670, LY T670, LG T670, LP T670 LSG T670, LSP T670, LSY T670, LOP T670, LYG T670 LG T671, LOG T671, LSG T671 LB T673, LV T673, LT T673, LW T673 LH T674 LS T676, LA T676, LO T676, LY T676, LB T676, LH T676, LSB T676, LW T676 LB T67C, LV T67C, LT T67C, LS T67K, LO T67K, LY T67K, LW E67C LS E67B, LA E67B, LO E67B, LY E67B, LB E67C, LV E67C, LT E67C LW T67C LS T679, LY T679, LG T679 LS T770, LO T770, LY T770, LG T770, LP T770 LB T773, LV T773, LT T773, LW T773 LH T774 LS E675, LA E675, LY E675, LS T675 LS T776, LA T776, LO T776, LY T776, LB T776 LHGB T686 LT T68C, LB T68C - Hyper Mini TOPLED® LB M676 - Mini TOPLED Santana® LG M470 LS M47K, LO M47K, LY M47K Source: http://www.osram.convergy.de/
IC1 IC2 = linear:78*: Positive VOLTAGE REGULATOR Source: http://cache.national.com/ds/LM/LM78L05.pdf http://www.fairchildsemi.com/ds/LM/LM7805.pdf
IC3 = linear:OPA2333: DUAL 1.8V, microPOWER CMOS OPERATIONAL AMPLIFIERS Zerø-Drift Series Source: Texas Instruments (Burr-Brown) .. U11 opa333 Operational Amp.pdf
JP1 JP2 = pinhead:PINHD-2X6: PIN HEADER
JP3 JP4 = adafruit:PINHD-2X4: PIN HEADER
JP5 = adafruit:PINHD-1X3: PIN HEADER
JP6 = SparkFun-Connectors:AUDIO-JACK: 3.5mm Audio Jack Simple 3.5mm common PCB mount audio jack. Variant PTH is our storefront SKU PRT-08032
R1-R25 R30 = rcl:R-US_: RESISTOR, American symbol
S1 = switch-omron:10-XX: OMRON SWITCH; MPN: B3F-1000; OC_FARNELL: 176432; OC_NEWARK: 36M3542
S2 = switch:55?-1LED: PUSHBUTTON SERIES 5500 SWITCHES 1 LED Source: www.e-switch.com .. 5500.pdf
S3 = switch:REKN: PUSH SWITCH ITT-Cannon-Cannon
S4 = switch:9070-1W: TOGGLE SWITCH Marquardt
U1 = SparkFun-Connectors:SD_CARD_SOCKET: SD Memory Card Connector, push-push normal type, CD enable, WP enable
U2 = microbuilder:VS1053B: VS1053b Audio Codec - Ogg Vorbis/MP3/AAC/WMA/FLAC/MIDI
U$1 = SparkFun-RF:BLUETOOTH-RN-52
U$2 = adafruit:PNA460XM: IR 38KHz receiver PNA4602 and related receivers http://www.ladyada.net/library/pcb/eaglelibrary.html
U$8 = pic33fj256gp710Apf:DSPIC33FJ256GP710A-X_PF
U$13 = con-amphenol:RCANEW
U$15 = XXXXXXtube supl:ADG884
X1 = con-xmultiple:XRJK*6: RJ11 Connector without LED, 6 position, 6 contacts, shielded, thrue hole Source: XRJK-S-01-6-6-0-2G2-NO(01).pdf
Y1-Y3 = microbuilder:CRYSTAL: Crystals HC49UP - Surface Mount Crystal 4.0MHz 18pF +/-30ppm Surface Mount Crystal [Digikey: 535-9857-1-ND] 12.0 MHz Surface Mount Crystal [Digikey: 535-9869-6-ND] 25.0 MHz Surface Mount Crystal [Digikey: 535-9078-1-ND] 2.5 x 2.0mm - MEMs SMT Crystal 16.0 MHz 10pF 20ppm 2.5 x 2.0mm Crystal [Digikey -40-85°C: 535-10923-1-ND] 3.2 x 2.5mm - MEMs SMT Crystal 12.0 MHz 8pF 15ppm 3.2 x 2.5mm Crystal [Digikey: -10-70°C: 644-1047-1-ND -40-125°C: 644-1128-1-ND] 16.0 MHz 8pF 15ppm 3.2 x 2.5mm Crystal [Digikey: -10-70°C: 644-1049-1-ND -40-125°C: 644-1129-2-ND] 16.0 MHz 10pF 10ppm 3.2 x 2.5mm Crystal [Digikey: 644-1100-1-ND] 27.12 MHz 18pF 30ppm 3.2 x 2.5mm Crystal [Digikey: 887-1424-1-ND] 27.12MHz 10pF 10ppm 3.2 x 2.5mm Crystal [Digikey: 887-1329-1-ND] 4.9 x 1.8mm - MEMs SMT Crystal 32.768 KHz 12.5pF 20ppm 4.9 x 1.8mm Crystal [Digikey: SE2415CT-ND] 8.0 x 3.8mm - Surface Mount Crystal 32.768kHz 12.5pF 20ppm -40°C-85°C [Digikey: 535-9166-2-ND] Cylinder 32.768KHz Cylinder Crystal (2x6mm body) [Ex. Digikey: 300-8341-2-ND]

## Board
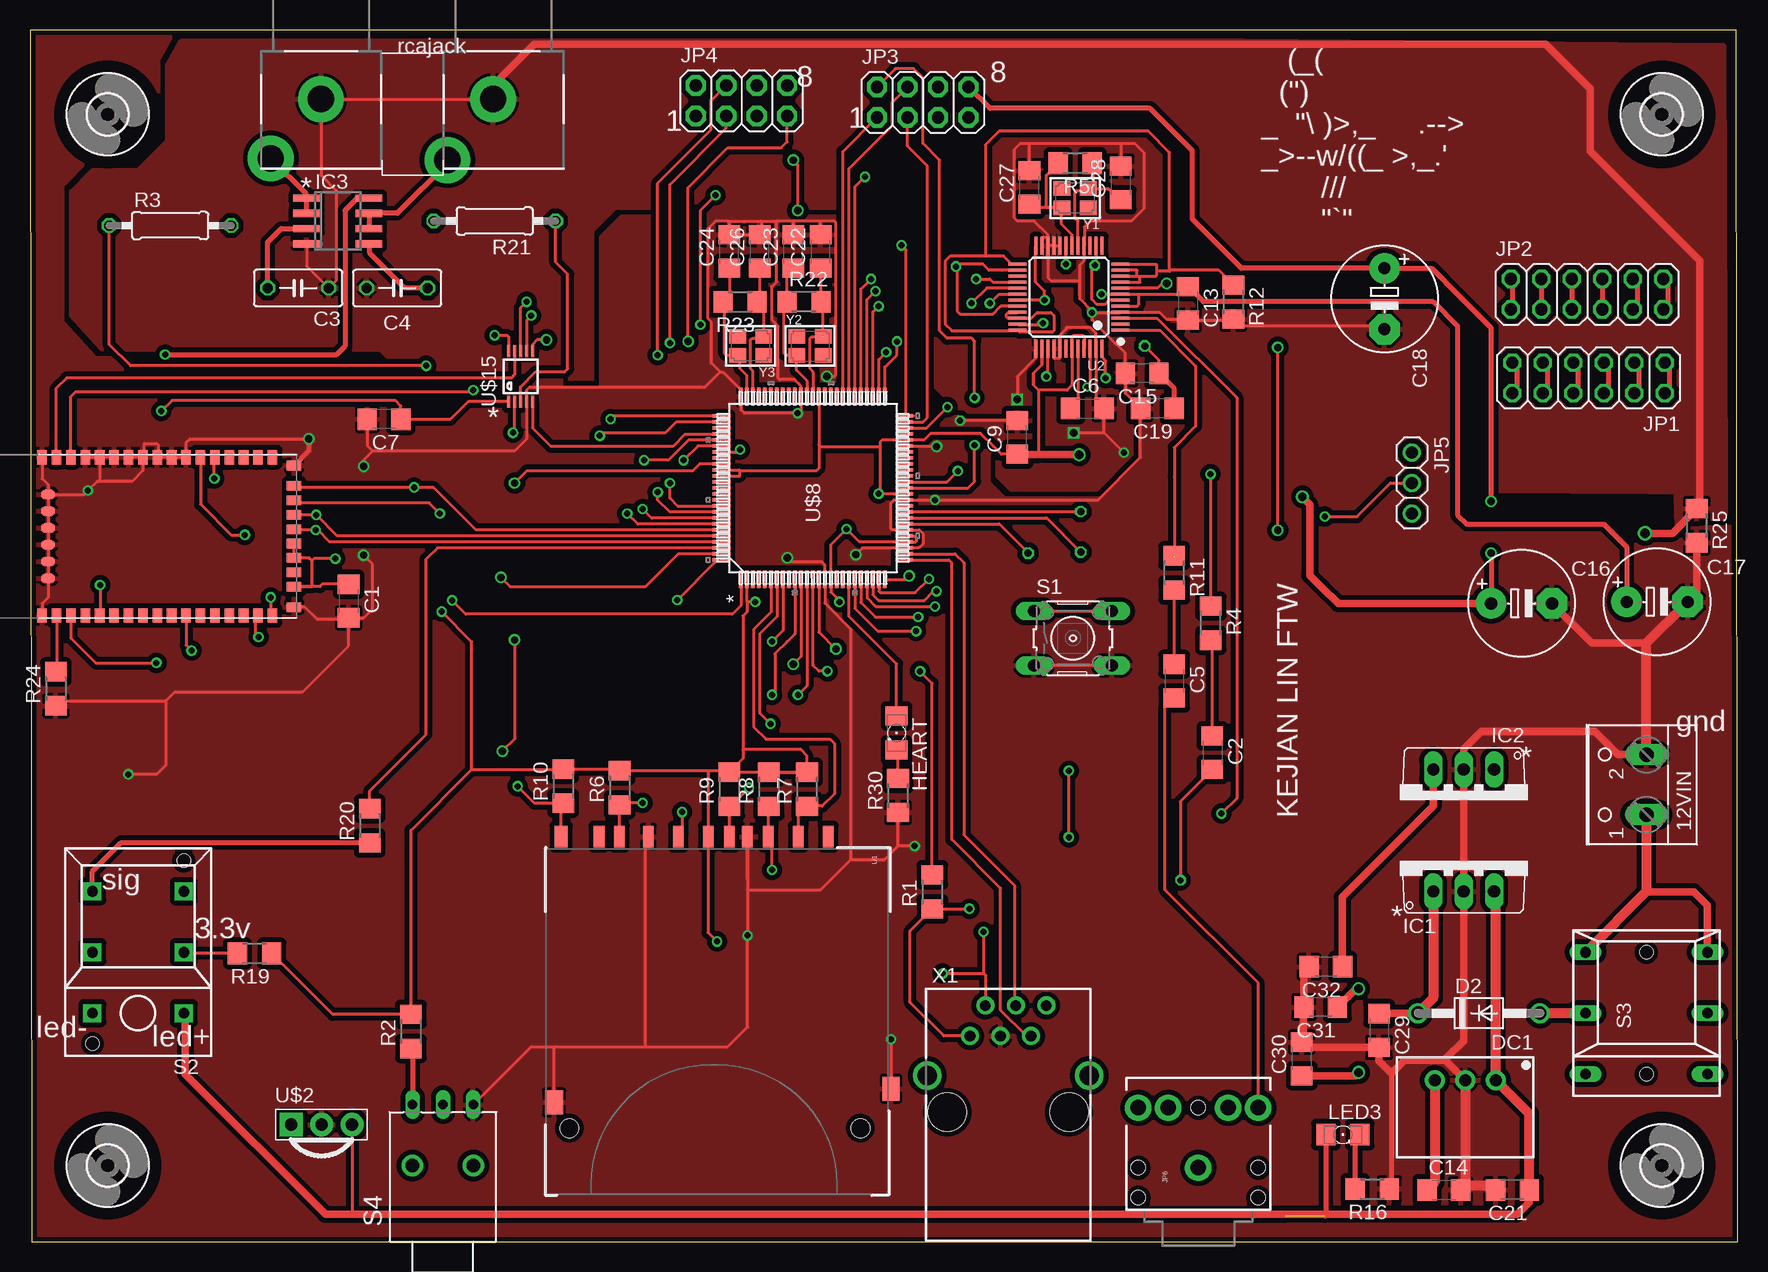
[diagram p7: board, top side]
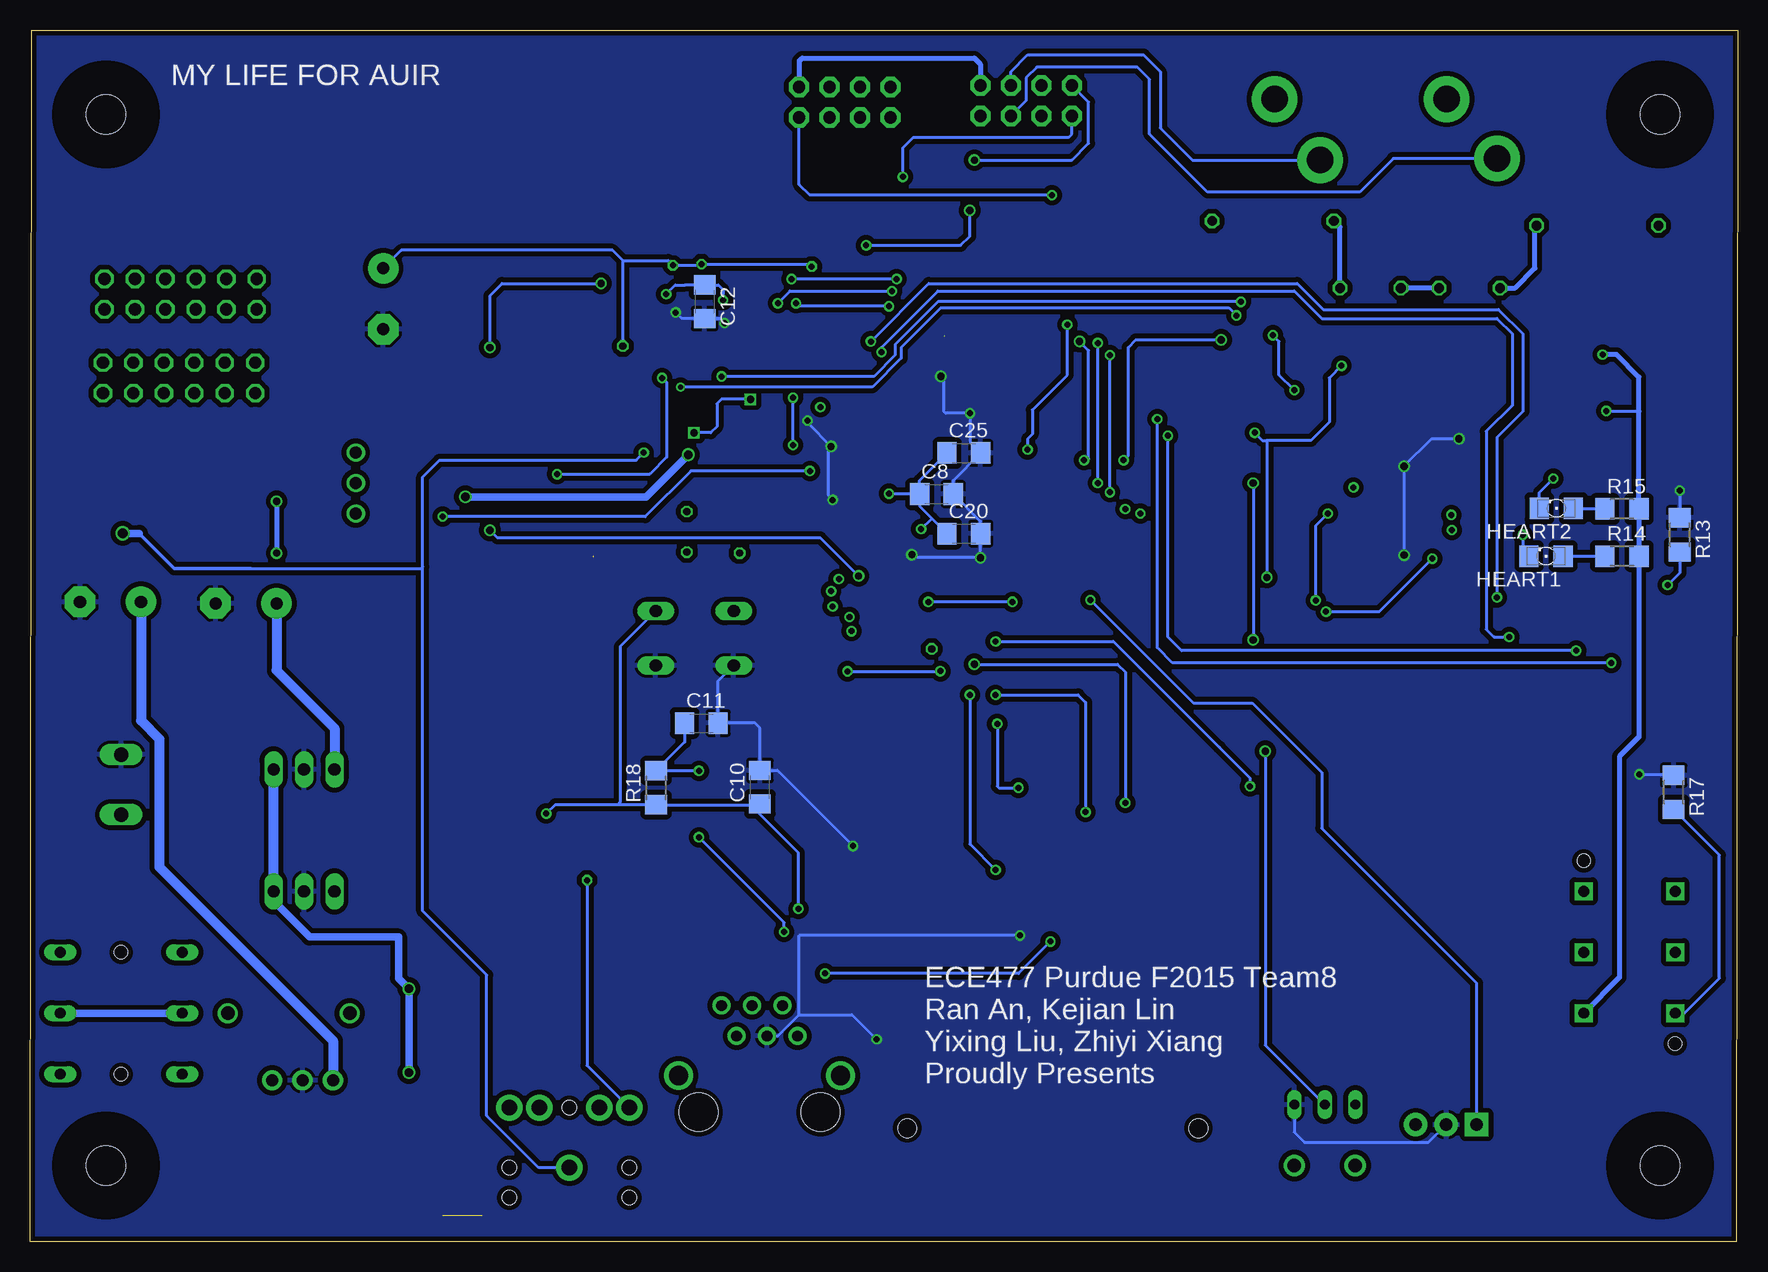
[diagram p8: board, bottom side, seen from below]

Size 142.35 x 101.02 mm. Coordinates in mm from the lower left corner, seen from the top.
Outline: 0.13,0 142.35,0 142.22,101.02 0,101.02 0.13,0
Copper layers (1*16): Top 0.0356mm / dielectric 1.5011mm / Bottom 0.0356mm
Design rules "477rec": minimum track width 8mil, minimum drill 13mil, track to track 8mil, track to pad 8mil, pad to pad 6mil, via to via 8mil, smd to smd 6mil, copper to edge 15mil, drill to drill 8mil, minimum pad ring 7mil, minimum via ring 7mil, stop-mask expansion 3mil, vias tented up to drill 0mil, thermal gap 10mil

### Footprints (pad centres in the part's own frame; a part is rotated, then mirrored left to right if it is on the bottom)
W237-102 = drill 1.194 long: 1 -2.5,-1.27; 2 2.5,-1.27
C1206 = smd 1.6 x 1.8: 1 -1.4,0; 2 1.4,0
C050-030X075 = drill 0.813 octagon: 1 -2.54,0; 2 2.54,0
E5-8,5 = drill 1.016 pad 2.54: + -2.54,0 | drill 1.016 pad 2.54 octagon: - 2.54,0
DO41-10 = drill 1.118: A 5.08,0; C -5.08,0
SIP3 = drill 1 pad 1.676: 1 -2.54,0; 2 0,0; 3 2.54,0
1206 = smd 1.6 x 1.803: A -1.422,0; C 1.422,0
TO220V = drill 1.016 long: 1 -2.54,-2.54; 2 0,-2.54; 3 2.54,-2.54
SO08 = smd 0.6 x 2.2: 1 -1.905,-2.6; 2 -0.635,-2.6; 3 0.635,-2.6; 4 1.905,-2.6; 5 1.905,2.6; 6 0.635,2.6; 7 -0.635,2.6; 8 -1.905,2.6
2X06 = drill 1.016 octagon: 1 -6.35,-1.27; 2 -6.35,1.27; 3 -3.81,-1.27; 4 -3.81,1.27; 5 -1.27,-1.27; 6 -1.27,1.27; 7 1.27,-1.27; 8 1.27,1.27; 9 3.81,-1.27; 10 3.81,1.27; 11 6.35,-1.27; 12 6.35,1.27
2X04 = drill 1.016 pad 1.676 octagon: 1 -3.81,-1.27; 2 -3.81,1.27; 3 -1.27,-1.27; 4 -1.27,1.27; 5 1.27,-1.27; 6 1.27,1.27; 7 3.81,-1.27; 8 3.81,1.27
1X03 = drill 1.016: 1 -2.54,0; 2 0,0; 3 2.54,0
AUDIO-JACK = drill 1.3 pad 2.184: RING 5,5; RSH 5,2.5; SLEEVE 0,0; TIP 5,-5; TSH 5,-2.5 | hole 1.2: 0,5; -2.5,5; -2.5,-5; 0,-5; 5,0
R1206 = smd 1.6 x 1.803: 1 -1.422,0; 2 1.422,0
0207/10 = drill 0.813 octagon: 1 -5.08,0; 2 5.08,0
B3F-10XX = drill 1.016 long: 1 -3.251,2.261; 2 3.251,2.261; 3 -3.251,-2.261; 4 3.251,-2.261
5501-1LED = drill 0.9 pad 1.5 square: 1A 0,3.81; 1B 0,-3.81; + -5.08,-3.81; - -5.08,3.81; NC 5.08,-3.81; NO 5.08,3.81 | hole 1.1: -7.62,3.81; 7.62,-3.81
REKN = drill 0.9 long: 0A 5.08,5.08; 0B 5.08,-5.08; 1A 0,5.08; 1B 0,-5.08; A -5.08,5.08; B -5.08,-5.08 | hole 1.1: -5.08,0; 5.08,0
9070-1W = drill 0.813 long: 1 5.08,-2.54; 2 5.08,0; 3 5.08,2.54 | drill 1.118 pad 1.778: B 0,-2.54; B1 0,2.54
SD_1:1 = smd 1.8 x 0.9: 1 -1,6.77; 2 -1,4.27; 3 -1,2.52; 4 -1,-0.73; 5 -1,-3.23; 6 -1,-5.73; 7 -1,-8.15; 8 -1,-9.85; 9 -1,9.27; CD -1,1.02 | smd 2 x 1.4: SH@1 20,14.496 | smd 2 x 1.527: SH@2 21.15,-13.589 | smd 1.8 x 1.1: WP -1,-13 | hole 1.55: 23.3,11.94; 23.3,-12.32
LQFP48 = smd 1.5 x 0.25: 1 -4.3,2.75; 2 -4.3,2.25; 3 -4.3,1.75; 4 -4.3,1.25; 5 -4.3,0.75; 6 -4.3,0.25; 7 -4.3,-0.25; 8 -4.3,-0.75; 9 -4.3,-1.25; 10 -4.3,-1.75; 11 -4.3,-2.25; 12 -4.3,-2.75; 25 4.3,-2.75; 26 4.3,-2.25; 27 4.3,-1.75; 28 4.3,-1.25; 29 4.3,-0.75; 30 4.3,-0.25; 31 4.3,0.25; 32 4.3,0.75; 33 4.3,1.25; 34 4.3,1.75; 35 4.3,2.25; 36 4.3,2.75 | smd 0.25 x 1.5: 13 -2.75,-4.3; 14 -2.25,-4.3; 15 -1.75,-4.3; 16 -1.25,-4.3; 17 -0.75,-4.3; 18 -0.25,-4.3; 19 0.25,-4.3; 20 0.75,-4.3; 21 1.25,-4.3; 22 1.75,-4.3; 23 2.25,-4.3; 24 2.75,-4.3; 37 2.75,4.3; 38 2.25,4.3; 39 1.75,4.3; 40 1.25,4.3; 41 0.75,4.3; 42 0.25,4.3; 43 -0.25,4.3; 44 -0.75,4.3; 45 -1.25,4.3; 46 -1.75,4.3; 47 -2.25,4.3; 48 -2.75,4.3
RN-52 = smd 1.2 x 0.8: 1 -6.6,8.33; 2 -6.6,7.13; 3 -6.6,5.93; 4 -6.6,4.73; 5 -6.6,3.53; 6 -6.6,2.33; 7 -6.6,1.13; 8 -6.6,-0.07; 9 -6.6,-1.27; 10 -6.6,-2.47; 11 -6.6,-3.67; 12 -6.6,-4.87; 13 -6.6,-6.07; 14 -6.6,-7.27; 15 -6.6,-8.47; 16 -6.6,-9.67; 25 6.6,-9.67; 26 6.6,-8.47; 27 6.6,-7.27; 28 6.6,-6.07; 29 6.6,-4.87; 30 6.6,-3.67; 31 6.6,-2.47; 32 6.6,-1.27; 33 6.6,-0.07; 34 6.6,1.13; 35 6.6,2.33; 36 6.6,3.53; 37 6.6,4.73; 38 6.6,5.93; 39 6.6,7.13; 40 6.6,8.33; G1 -6.6,9.53; G4 6.6,9.53 | smd 0.8 x 1.2: 17 -4.2,-11.47; 18 -3,-11.47; 19 -1.8,-11.47; 20 -0.6,-11.47; 21 0.6,-11.47; 22 1.8,-11.47; 23 3,-11.47; 24 4.2,-11.47; G2 -5.9,-11.47; G3 5.9,-11.46; RFG1 -3.5,9.03; RFG2 -2.1,9.03; RFG3 -0.7,9.03; RFG4 0.7,9.03; RFG5 2.1,9.03; RFG6 3.5,9.03
PNA460XM = drill 1.016 pad 1.93 square: 1 -2.54,0 | drill 1.016 pad 1.93: 2 0,0; 3 2.54,0
TQFP100_14X14MC = smd 1.473 x 0.279: 1 -7.62,6; 2 -7.62,5.5; 3 -7.62,5; 4 -7.62,4.5; 5 -7.62,4; 6 -7.62,3.5; 7 -7.62,3; 8 -7.62,2.5; 9 -7.62,2; 10 -7.62,1.5; 11 -7.62,1; 12 -7.62,0.5; 13 -7.62,0; 14 -7.62,-0.5; 15 -7.62,-1; 16 -7.62,-1.5; 17 -7.62,-2; 18 -7.62,-2.5; 19 -7.62,-3; 20 -7.62,-3.5; 21 -7.62,-4; 22 -7.62,-4.5; 23 -7.62,-5; 24 -7.62,-5.5; 25 -7.62,-6; 51 7.62,-6; 52 7.62,-5.5; 53 7.62,-5; 54 7.62,-4.5; 55 7.62,-4; 56 7.62,-3.5; 57 7.62,-3; 58 7.62,-2.5; 59 7.62,-2; 60 7.62,-1.5; 61 7.62,-1; 62 7.62,-0.5; 63 7.62,0; 64 7.62,0.5; 65 7.62,1; 66 7.62,1.5; 67 7.62,2; 68 7.62,2.5; 69 7.62,3; 70 7.62,3.5; 71 7.62,4; 72 7.62,4.5; 73 7.62,5; 74 7.62,5.5; 75 7.62,6 | smd 0.279 x 1.473: 26 -6,-7.62; 27 -5.5,-7.62; 28 -5,-7.62; 29 -4.5,-7.62; 30 -4,-7.62; 31 -3.5,-7.62; 32 -3,-7.62; 33 -2.5,-7.62; 34 -2,-7.62; 35 -1.5,-7.62; 36 -1,-7.62; 37 -0.5,-7.62; 38 0,-7.62; 39 0.5,-7.62; 40 1,-7.62; 41 1.5,-7.62; 42 2,-7.62; 43 2.5,-7.62; 44 3,-7.62; 45 3.5,-7.62; 46 4,-7.62; 47 4.5,-7.62; 48 5,-7.62; 49 5.5,-7.62; 50 6,-7.62; 76 6,7.62; 77 5.5,7.62; 78 5,7.62; 79 4.5,7.62; 80 4,7.62; 81 3.5,7.62; 82 3,7.62; 83 2.5,7.62; 84 2,7.62; 85 1.5,7.62; 86 1,7.62; 87 0.5,7.62; 88 0,7.62; 89 -0.5,7.62; 90 -1,7.62; 91 -1.5,7.62; 92 -2,7.62; 93 -2.5,7.62; 94 -3,7.62; 95 -3.5,7.62; 96 -4,7.62; 97 -4.5,7.62; 98 -5,7.62; 99 -5.5,7.62; 100 -6,7.62
3,3 = hole 3.3: 0,0
RCA = drill 2.2 pad 3.81: R+ 5.08,-4.699; R- 0,-0.889; W+ 4.953,-19.431; W- 0,-15.24
MSOP10 = smd 0.25 x 1: 1 -1,-2.113; 2 -0.5,-2.113; 3 0,-2.113; 4 0.5,-2.113; 5 1,-2.113; 6 1,2.113; 7 0.5,2.113; 8 0,2.113; 9 -0.5,2.113; 10 -1,2.113
XRJK-S-01-6-6-0-2G2-NO = drill 0.9 pad 1.5: 1 -3.175,6.35; 2 -1.905,8.89; 3 -0.635,6.35; 4 0.635,8.89; 5 1.905,6.35; 6 3.175,8.89 | drill 1.6 pad 2.184: S1 -6.75,3.05; S2 6.75,3.05 | hole 3.2: -5.08,0; 5.08,0
CRYSTAL_3.2X2.5 = smd 1.4 x 1.2: 1 -1.1,-0.8; 2 1.1,0.8; GND1 -1.1,0.8; GND2 1.1,-0.8

### Placement (x,y rotation side)
12VIN  133.48,38.1 90 top
C1  26.56,53.41 270 top
C2  98.55,40.77 270 top
C3  22.35,79.5 180 top
C4  30.61,79.5 0 top
C5  95.38,46.74 270 top
C6  88.14,69.47 0 top
C7  29.52,68.57 180 top
C8  66.79,62.33 0 bottom
C9  82.3,67.06 90 top
C10  81.5,37.89 90 bottom
C11  86.38,43.23 0 bottom
C12  86.11,78.36 270 bottom
C13  96.52,78.23 270 top
C14  117.86,4.32 0 top
C15  92.71,72.39 180 top
C16  124.33,53.21 0 top
C17  135.64,53.34 0 top
C18  112.9,78.61 270 top
C19  93.98,69.47 180 top
C20  64.5,59.03 0 bottom
C21  123.57,4.32 180 top
C22  65.91,82.55 90 top
C23  63.63,82.55 90 top
C24  58.29,82.55 90 top
C25  64.5,65.76 0 bottom
C26  60.83,82.55 90 top
C27  83.31,87.88 90 top
C28  90.93,88.27 90 top
C29  112.46,17.61 270 top
C30  106.01,15.24 90 top
C31  107.59,19.56 180 top
C32  108.02,22.92 180 top
D2  120.78,19.05 0 top
DC1  119.63,13.46 180 top
HEART  72.23,42.41 270 top
HEART1  15.98,57.15 180 bottom
HEART2  15.11,61.14 180 bottom
IC1  119.51,31.75 0 top
IC2  119.51,36.83 180 top
IC3  25.65,85.09 270 top
JP1  129.92,72.01 180 top
JP2  129.79,78.99 0 top
JP3  74.42,95 0 top
JP4  59.31,95.12 0 top
JP5  115.19,63.25 270 top
JP6  97.38,6.17 90 top
LED3  109.44,8.93 0 top
R1  75.2,29.16 90 top
R2  31.75,17.53 90 top
R3  11.68,84.71 0 top
R4  98.42,51.56 270 top
R5  87.12,89.92 180 top
R6  49.15,37.85 90 top
R7  64.77,37.72 90 top
R8  61.6,37.72 90 top
R9  58.29,37.72 90 top
R10  44.45,37.97 90 top
R11  95.38,55.75 270 top
R12  100.32,78.33 270 top
R13  4.83,58.93 270 bottom
R14  9.65,57.15 0 bottom
R15  9.65,61.09 0 bottom
R16  111.89,4.39 180 top
R17  5.33,37.47 270 bottom
R18  90.16,37.85 90 bottom
R19  18.72,24.04 180 top
R20  28.32,34.67 90 top
R21  38.73,85.09 180 top
R22  64.52,78.36 0 top
R23  59.18,78.36 180 top
R24  2.16,46.1 90 top
R25  138.94,59.69 270 top
R30  72.35,37.2 90 top
S1  86.93,50.31 0 top
S2  9.02,24.13 90 top
S3  134.75,19.05 90 top
S4  34.42,6.35 90 top
U1  57.28,32.77 270 top
U2  86.61,78.74 180 top
U$1  10.54,58.8 90 top
U$2  24.3,9.77 0 top
U$8  65.26,62.84 90 top
U$9  [3,3]  6.48,93.98 0 top
U$10  [3,3]  6.48,6.35 0 top
U$11  [3,3]  136.02,93.98 0 top
U$12  [3,3]  136.02,6.35 0 top
U$13  39.5,95.25 270 top
U$15  40.89,72.14 0 top
X1  81.53,10.79 0 top
Y1  87.12,87 180 top
Y2  65.02,74.68 0 top
Y3  60.07,74.68 180 top

### Tracks (layer width: path | path; a pad name or v marks a point on that pad's centre or on a via)
#1-SDI  (via drill 0.5)
  Top 0.254: v80.01,78.23 80.77,78.99 U2.30 | U$8.54 69.76,77.86 | 69.76,77.86 | 69.76,77.86 69.76,78.53 v70.48,79.25
  Bottom 0.254: v70.48,79.25 78.99,79.25 v80.01,78.23
#4-RESET  (via drill 0.5)
  Top 0.254: U2.3 93.95,76.99 100.58,70.36 100.58,36.96 v99.31,35.69 | X1.1 76.18,17.14 73.36,19.96 73.36,25.9 R1.1 78.27,27.74 v78.3,27.76 | S1.1 S1.2
  Bottom 0.254: S1.2 93.15,49.61 93.15,36.63 93.34,36.43 | 93.34,36.43 R18.1 82.3,36.43 | 93.34,36.43 98.57,36.43 v99.31,35.69 | 82.3,36.43 81.56,36.43 C10.1 | v78.3,27.76 78.3,32.42 82.3,36.43
#5-CLOCKBUS  (via drill 0.5)
  Top 0.254: U$8.55 69.26,79.42 v70.1,80.26 | v78.87,80.26 80.01,80.26 80.26,80.01 82.29,80.01 U2.28
  Bottom 0.254: v70.1,80.26 v78.87,80.26
#7-MISO  (via drill 0.5)
  Top 0.254: U$8.53 70.26,77.5 v70.74,77.98 | U2.29 82.3,79.5 79.76,79.5 v78.49,78.23
  Bottom 0.254: v70.74,77.98 78.23,77.98 v78.49,78.23
AFTR
  Top 0.254: 95,80.9 95.12,81.03 99.05,81.03 R12.1 100.27,79.76 | 92.55,80.49 U2.10 92.27,80.49 92.28,80.48 92.28,80.98 92.29,81 U2.11 | 92.55,80.49 93.82,80.49 93.9,80.56 93.9,80.9 | U2.12 93.9,81.49 93.9,80.9 | 82.27,75.95 76.83,75.95 76.33,76.45 76.33,81.79 76.71,82.17 79.63,82.17 | 82.27,75.95 U2.36 82.48,75.82 | U2.33 82.29,77.47 81.53,77.47 81.41,77.34 81.41,77.09 81.51,76.99 U2.34 83.47,76.99 83.95,77.47 85.09,77.47 85.34,77.22 85.34,75.95 85.22,75.82 82.48,75.82 | U2.25 81.83,81.49 81.15,82.17 79.63,82.17 | 95,80.9 95,90.81 93.22,92.58 80.77,92.58 79.63,91.44 79.63,82.17 | 95,80.9 93.9,80.9 | 82.48,75.82 82.48,75.88 82.42,75.95 82.27,75.95 | U2.9 92.53,79.99 92.54,79.98 92.54,80.48 92.55,80.49
AGND  (via drill 0.5, 0.6, 0.8)
  Top 0.254: 82.29,72.13 82.3,72.14 | U2.37 83.82,74.4 83.82,73.66 82.3,72.14 | v91.19,65.79 89.53,67.44 | 89.53,67.44 C6.2 88.86,70.14 U2.47 88.86,75.73 88.39,76.2 86.36,76.2 86.36,76.07 85.85,75.56 85.85,74.45 U2.41 85.86,73.67 85.85,73.66 85.34,73.66 | U$13.R- U$13.W- 24.26,88.9 25.53,87.63 25.53,80.14 C3.1 23.05,81.34 IC3.4 | 85.34,73.66 85.34,74.42 U2.40 85.36,73.68 85.34,73.66 | 82.3,72.14 v82.3,70.23 | v86.99,67.44 89.53,67.44
  Top 0.61: U$13.R- 38.61,96.39 42.04,99.82 126.36,99.82 130.05,96.14 130.05,90.93 139.19,81.79 139.19,61.37 R25.1 136.88,59.05 v134.62,59.05
  Bottom 0.254: 109.6,56.26 109.6,27.56 104.28,22.24 104.28,10.5 99.95,6.17 JP6.SLEEVE | 109.6,56.26 109.6,63.75 108.2,65.15 91.82,65.15 v91.19,65.79 | v82.3,70.23 84.71,70.23 85.09,69.85 85.09,67.94 85.6,67.44 v86.99,67.44 | 123.95,56.13 109.73,56.13 109.6,56.26
  Bottom 0.305: 123.95,56.13 130.31,56.13 133.23,59.05
  Bottom 0.406: C3.1 C4.1
  Bottom 0.61: v134.62,59.05 133.23,59.05
  pour Top (isolate 0.406): 9.02,89.28 5.21,89.28 3.43,87.5 3.43,77.22 5.97,74.42 29.21,74.42 32.64,70.99 32.64,66.67 34.8,64.52 43.43,64.52 46.86,67.94 46.86,84.33 48.77,86.23 72.9,86.23 74.93,84.2 74.93,71.88 78.1,68.71 78.23,68.71 80.64,66.29 80.64,63.88 81.79,62.74 102.62,62.74 141.35,62.48 141.22,99.69 101.22,100.08 12.57,100.08 11.43,98.04 11.43,91.69
  pour Top: 137.16,63.37 137.29,59.56 137.92,60.2 140.46,60.33 141.1,60.33 141.35,60.58 141.35,63.25 141.22,63.37
AUDIO_L  (via drill 0.5, 0.6)
  Top 0.254: v40.26,67.44 40.39,67.56 U$15.2 | v33.02,73.03 8.38,73.03 6.6,74.8 R3.1 | v39.24,55.37 40.01,54.61 51.31,54.61 54.04,57.34 U$8.99
  Bottom 0.254: v33.02,73.03 34.04,72.01 34.04,68.33 35.56,66.8 39.24,66.8 | 39.24,66.8 39.62,66.8 v40.26,67.44 | 39.24,66.8 v39.24,55.37
AUDIO_R
  Top 0.254: R21.1 43.82,81.66 44.83,80.64 44.83,72.77 44.58,72.52 42.16,72.52 40.89,71.25 U$15.3
BARBLANK  (via drill 0.5)
  Top 0.254: U$8.92 53.34,60.84 52.32,61.85 v52.32,62.48 | v52.32,73.91 52.32,88.27 56.77,92.71 56.77,95.12 JP4.4
  Bottom 0.254: v52.32,62.48 v52.32,73.91
BARCLOCK  (via drill 0.5, 0.6)
  Top 0.254: U$8.50 73.03,68.84 | 73.66,68.84 73.03,68.84 | 73.03,68.84 73.02,68.83 73.02,82.68 v72.64,83.06 | v64.01,85.98 64.01,89.79 v63.63,90.17
  Bottom 0.254: v72.64,83.06 64.77,83.06 64.01,83.82 v64.01,85.98 | JP4.2 54.1,95 54.1,91.57 55.5,90.17 v63.63,90.17
BARDATA  (via drill 0.5)
  Top 0.254: U$8.91 53.98,61.34 53.34,61.98 v53.34,63.25 | v53.34,74.93 53.34,88.14 58.04,92.84 JP4.3
  Bottom 0.254: v53.34,63.25 v53.34,74.93
BARLATCH  (via drill 0.5)
  Top 0.254: U$8.56 68.76,87.94 v69.6,88.77
  Bottom 0.254: v69.6,88.77 69.6,91.19 68.71,92.08 55.75,92.08 55.5,92.33 JP4.1
CVDD  (via drill 0.5)
  Top 0.254: 92.47,78.99 U2.7 v89.31,78.99 | 92.47,78.99 95.88,78.99 C13.1 | U2.31 v84.58,78.49 84.58,79.25 83.82,80.01 83.82,83 U2.24 | U2.5 92.28,77.99 92.46,78.17 92.46,78.98 92.47,78.99
  Top 0.406: C17.+ 133.1,57.91 131.19,59.82 119.76,59.82 119,60.58 119,76.33 116.97,78.36 97.79,78.36 C13.1 96.54,79.62
  Top 0.813: DC1.3 117.09,4.96 C14.1
  Bottom 0.254: v84.58,78.49 84.58,79.38 84.97,79.76 C12.1 87.75,79.76 87.76,79.76 88.57,79.76 89.31,79.02 v89.31,78.99
  Bottom 0.813: C17.+ 133.1,43.43 131.57,41.91 131.57,31.24 117.09,16.76 DC1.3
DCI_CLK
  Top 0.254: 22.02,62.99 U$1.24 22.15,62.87 33.66,62.87 37.18,59.34 U$8.95
DCI_IN
  Top 0.254: U$8.97 24.97,58.34 24,59.31 22.1,59.31 U$1.21
DCI_OUT
  Top 0.254: U$8.96 25.62,58.84 23.88,60.58 22.03,60.58 U$1.22
DCI_SYNC  (via drill 0.5)
  Top 0.254: U$8.1 59.26,53.03 59.04,52.8 59.03,52.8 58.55,52.32 36.32,52.32 v35.18,53.47 | v34.16,60.71 33.27,61.59 22.22,61.59 U$1.23
  Bottom 0.254: v35.18,53.47 35.18,59.69 v34.16,60.71
DREQ  (via drill 0.6)
  Top 0.254: U$8.25 73,55.22 v73.28,55.5 | v104.01,59.31 v104.01,74.55 | v94.74,79.88 94.36,79.88 93.98,79.5 90.93,79.5 U2.8
  Bottom 0.254: v104.01,59.31 103.38,58.67 76.45,58.67 v73.28,55.5 | v104.01,74.55 104.01,78.87 103,79.88 v94.74,79.88
GND  (via drill 0.5, 0.6)
  Top 0.254: S1.4 S1.3 | 95.86,77.49 96.16,77.19 | 96.16,77.19 C13.2 100.05,76.83 R12.2 100.56,76.33 112.65,76.33 | U2.35 82.35,76.45 84.33,76.45 v84.45,76.58 | v88.52,77.47 90.89,77.47 U2.4 94.14,77.49 94.73,76.9 95.86,76.9 96.16,77.19 | 84.86,82.14 U2.22 84.84,83.07 84.84,83.69 | 87.88,83.02 87.88,81.79 87.5,81.41 87.5,80.14 | 87.88,83.02 U2.16 | 59.82,30.19 U1.3 | U1.3 59.8,25.55 v59.82,25.53 59.82,17.91 58.17,16.26 51.29,16.26 | 5.59,65.62 U$1.37 | U1.3 59.8,29.36 59.82,29.34 65.91,29.34 68.45,31.88 | 68.45,31.88 68.45,51.05 66.26,53.24 U$8.15 66.26,56.42 66.04,56.64 63.5,56.64 v63.12,57.02 | 84.84,83.19 84.96,83.06 | 84.84,83.69 84.84,83.95 83.69,85.09 82.3,85.09 82.04,85.34 82.04,91.06 82.55,91.57 83.31,91.57 | U$1.34 9.41,64.28 8.51,63.37 5.84,63.37 | 5.84,63.37 5.59,63.37 v4.83,62.61 4.52,62.3 U$1.RFG6 | v88.52,77.47 88.52,77.6 87.5,78.61 87.5,80.14 | 84.86,82.14 84.84,82.17 84.84,82.93 84.96,83.06 | 11.3,45.09 11.3,39.71 10.55,38.96 8.21,38.96 v8.2,38.97 | 9.53,65.91 9.53,65.52 U$1.34 | U$1.38 U$1.37 | U$1.37 5.81,63.4 5.84,63.37 | U$1.34 U$1.35 | U$1.34 9.41,65.8 9.53,65.91 | 9.53,65.91 9.53,66.55 10.54,66.55 10.67,66.42 10.67,65.46 U$1.33 U$1.32 U$1.31 13.01,66.61 13.34,66.93 v23.24,66.93 | 32.68,65.91 40.39,65.91 41.39,66.92 U$15.4 41.39,70.98 41.66,71.25 56.27,71.25 57.52,72.49 57.77,72.49 59.26,71 U$8.75 59.29,70.43 59.29,69.31 59.55,69.06 v63.99,69.06 64.26,69.33 U$8.65 64.26,71.33 63.74,71.85 62.51,71.85 62.36,72.01 62.36,76.33 61.85,76.83 61.85,79.63 62.23,80.01 62.23,85.09 | 32.68,65.91 28.57,65.91 | 28.57,65.91 27.81,65.15 v27.81,64.64 | v68.83,57.28 69.39,57.84 U$8.28 74.1,57.84 74.17,57.91 74.42,58.17 74.42,59.05 74.14,59.34 U$8.31 71.85,59.34 71.75,59.44 71.75,61.59 72.01,61.85 72.87,61.85 U$8.36 75.43,61.84 v75.44,61.85 89.03,61.85 92.58,65.41 C19.2 91.31,70.74 C15.2 91.31,74.06 89.87,75.5
  Top 0.254: S4.1 41.78,16.26 43.83,16.26 | 43.83,16.26 51.29,16.26 | 84.86,82.14 84.86,80.36 85.09,80.14 87.5,80.14 | 84.96,83.06 85.35,83.06 U2.21 U2.20 | 57.53,72.52 56.77,73.28 56.77,76.71 56.52,76.96 56.52,84.45 57.15,85.09 58.17,85.09 | 83.31,91.57 90.93,91.57 | 90.93,91.57 C28.2 | C27.2 83.31,91.57 | 90.93,91.57 92.07,91.57 92.84,90.81 92.84,86.11 91.82,85.09 88.39,85.09 87.88,84.58 87.88,83.02 | 84.84,83.69 84.33,83.69 84.33,83.08 U2.23 | 65.91,85.09 67.06,85.09 67.18,84.96 67.18,72.26 67.06,72.14 v66.42,72.14 | 65.91,85.09 63.75,85.09 | 63.75,85.09 62.23,85.09 | 58.17,85.09 58.29,84.96 C24.2 C26.2 | C23.2 63.63,84.96 63.75,85.09 | C22.2 65.91,85.09 | R24.1 2.39,44.68 2.79,45.09 11.3,45.09 | 11.3,45.09 12.07,45.85 22.73,45.85 26.55,49.67 26.55,52 C1.2 | 58.17,85.09 60.96,85.09 | 60.96,85.09 62.23,85.09 | 60.96,85.09 60.96,84.33 | U$8.45 75.52,66.34 v75.56,66.29 | v88.52,77.47 88.52,76.85 89.87,75.5 | 89.87,75.5 | 68.45,31.88 71.25,31.88 72.37,33 | 72.37,33 72.37,35.76 R30.1 | U$1.36 U$1.37 | U$1.G4 1.01,63.6 1.51,63.1 U$1.RFG6 | U$1.RFG6 U$1.RFG5 U$1.RFG4 U$1.RFG3 U$1.RFG2 U$1.RFG1 1.51,53.71 1.01,53.21 U$1.G1 | U$1.G2 22.02,52.91 22.91,52.91 23.92,51.9 26.45,51.9 C1.2 | C1.2 27.81,52.01 28.56,52.76 28.56,56.49 v27.81,57.24 | v77.54,68.46 C9.2 | C31.2 106.07,19.38 106.07,19.66 106.13,19.72 | 106.06,22.36 C32.2 106.19,22.49 | 106.66,16.21 C30.2 106.13,16.76 | U1.SH@2 43.69,16.11 43.83,16.26 | v71.77,16.87 U1.SH@1 | U1.SH@1 | v73.74,32.98 72.39,32.98 72.37,33 | 32.7,65.92 32.68,65.91 | C7.2 28.12,66.37 28.57,65.91 | 51.29,16.26 51.29,33.51 U1.6
  Top 0.305: C18.- 112.65,76.33
  Top 0.406: 117.98,15.11 117.98,15.24 | v23.24,66.93 23.24,65.94 U$1.G3 | 113.49,14.05 113.49,4.57 R16.1
  Top 0.61: DC1.2 117.98,15.11 114.55,15.11 113.49,14.05 112.46,15.08 C29.2 106.66,16.21 | 117.98,15.24 119.51,16.76 IC1.2 IC2.2 119.51,41.09 120.97,42.55 130.42,42.55 132.37,40.6 12VIN.2 | R25.2 138.94,54.1 C17.- | 106.13,19.72 106.13,16.76 | C31.2 106.19,22.49 | 134.75,49.91 130.18,49.91 C16.-
  Top 0.813: 12VIN.2 134.75,49.91 C17.- | DC1.2 119.63,4.7 | 119.63,4.7 C14.2 | 119.63,4.7 121.79,4.7 C21.2
  Bottom 0.254: v59.82,25.53 78.23,25.53 78.23,18.92 | v4.83,62.61 R13.1 | X1.3 80.01,17.14 78.23,18.92 | v68.83,57.28 68.58,57.02 v63.12,57.02 63.12,59.01 C20.2 63.1,60.04 C8.2 65.39,63.47 C25.2 63.99,66.65 v63.99,69.06 66.01,69.06 66.17,69.22 66.17,71.88 v66.42,72.14 | v75.44,61.85 75.82,62.23 75.82,66.04 v75.56,66.29 77.54,68.27 v77.54,68.46 | v23.24,66.93 25.53,66.93 v27.81,64.64 v27.82,64.64 v27.82,57.24 v27.81,57.24 | S4.1 36.96,9.14 36.12,8.3 25.77,8.3 U$2.2 | 78.23,18.92 73.83,18.92 v71.77,16.87 | S1.3 84.98,46.75 C11.2 84.96,43.25 81.91,43.25 81.5,42.84 C10.2 80.05,39.29 v73.74,32.98 | v8.2,38.97 5.42,38.97 R17.1 | C12.2 84.83,76.96 v84.45,76.58 84.84,76.96 88.01,76.96 v88.52,77.47 88.01,76.96 C12.2
  pour Bottom (isolate 0.406): 0.13,0 0.13,100.97 0.1,100.99 142.19,100.99 142.19,0.05 0.18,0.05
  pour Top (isolate 0.406, rank 3): 0.13,0 0.13,101 142.21,101 142.21,0.03 142.23,0.01 0.14,0.01
GPIO2  (via drill 0.5)
  Top 0.254: U$1.2 3.41,50.31 5.46,48.26 v10.54,48.26 | U$8.76 48.64,68.84 v48.39,68.58
  Bottom 0.254: v10.54,48.26 47.12,48.26 48.39,49.53 v48.39,68.58
GPIO9  (via drill 0.5)
  Top 0.254: U$1.10 13.01,49.73 v13.46,49.28 | v47.5,67.18 47.75,67.44 52.96,67.44 53.86,68.34 U$8.77
  Bottom 0.254: v13.46,49.28 46.36,49.28 47.5,50.42 v47.5,67.18
INPUT-SELECT  (via drill 0.6)
  Top 0.254: U$8.84 55.82,64.84 55.25,64.26 41.4,64.26 v40.39,63.25 | v40.39,50.16 40.39,41.91 v39.37,40.89
  Bottom 0.254: v40.39,63.25 v40.39,50.16 | v39.37,40.89 39.37,16.38 S4.2
IR  (via drill 0.5)
  Top 0.254: v53.95,53.49 v53.95,53.5 | v53.95,53.49 53.97,53.49 | v53.95,53.49 53.96,53.49 57.07,56.6 57.07,56.79 57.6,56.79 U$8.100
  Bottom 0.254: U$2.1 21.76,21.56 34.67,34.47 34.67,39.12 40.46,44.91 45.36,44.91 v53.95,53.49
LED_BAR  (via drill 0.5, 0.6)
  Top 0.254: U$8.81 55.67,66.34 v54.48,65.15 | v54.86,75.06 54.86,87.88 58.17,91.19 62.61,91.19 63.12,91.69 JP4.7
  Bottom 0.254: v54.48,65.15 54.23,65.15 54.1,65.28 54.1,74.3 v54.86,75.06
LED_VFD  (via drill 0.5)
  Top 0.254: U$8.82 58.98,65.84 v59.18,66.04 | v55.88,76.45 55.88,85.98 v57.15,87.25
  Bottom 0.254: v55.88,76.45 55.88,72.26 58.8,69.34 58.8,67.31 59.18,66.93 v59.18,66.04 | v57.15,87.25 77.34,87.25 78.23,88.14 JP3.7
LEFT_BT
  Top 0.254: U$15.9 40.39,72.27 40.13,72.01 3.05,72.01 2.16,71.12 2.16,65.45 U$1.40
LEFT_CODEC  (via drill 0.41, 0.5)
  Top 0.254: v88.11,71.25 88.27,71.25 88.39,71.37 88.39,74.41 U2.46 | v41.78,77.22 41.4,76.83 U$15.7
  Bottom 0.254: v88.11,71.25 72.14,71.25 69.72,73.66 69.72,74.55 66.42,77.85 42.42,77.85 v41.78,77.22
MUX1
  Top 0.254: U$15.5 41.89,67.83 43.43,66.29 53.59,66.29 54.61,67.31 57.62,67.31 U$8.79
MUX2  (via drill 0.5, 0.6)
  Top 0.254: U$8.80 54.9,66.84 53.21,65.15 v51.18,65.15 | v43.05,75.18 42.29,75.18 41.91,74.8 41.91,74.27 U$15.6
  Bottom 0.254: v51.18,65.15 50.8,65.53 50.8,74.55 50.16,75.18 v43.05,75.18
N$1  (via drill 0.5)
  Top 0.254: C2.2 95.88,36.7 95.88,30.16 v95.91,30.14
  Bottom 0.254: v95.91,30.14 95.91,14.7 JP6.RING
N$2  (via drill 0.5)
  Top 0.254: R1.2 75.2,46.55 v74.2,47.56 | v66.46,47.56 65.77,47.56 65.27,48.05 65.27,55.2 U$8.13
  Bottom 0.254: v74.2,47.56 v66.46,47.56
  Bottom 0.406: v66.46,47.56
N$3
  Top 0.406: R16.2 110.46,8.54 LED3.C
N$4
  Top 0.254: U2.44 87.36,70.09 C6.1
N$5
  Top 0.254: R19.2 12.92,24.04 S2.1B
N$6
  Top 0.254: 65.76,54.63 65.76,50.81 67.14,49.43
N$7  (via drill 0.6)
  other vias: 67.18,49.42
N$8
  Top 0.254: 73.61,60.86 87.53,60.86
N$9
  Top 0.254: R5.1 88.62,89.46 88.62,88.19 Y1.1 | U2.17 87.36,85.1 87.12,85.34 87.12,87.5 87.25,87.63 88.06,87.63 Y1.1 | Y1.1 89.88,87.8 90.3,87.38 90.42,87.38 C28.1
N$10
  Top 0.254: 73.52,60.34 84.72,60.34
N$11
  Top 0.254: 73.48,59.83 80.81,59.83 83.22,57.42
N$12
  Top 0.254: U2.18 86.86,83.95 85.98,84.84 85.98,86.15 Y1.2 | 85.62,89.46 R5.2 85.09,89.31 85.09,89.28 84.71,88.9 84.71,86.23 84.75,86.19 Y1.2 | Y1.2 83.6,86.19 C27.1
N$13
  Top 0.254: C2.1 98.55,50.01 R4.2
N$14  (via drill 0.5)
  Top 0.254: R4.1 98.42,60.96 98.42,60.97 v98.42,63.98 | U2.48 89.36,73.72 89.66,73.42 v89.66,72.01
  Bottom 0.254: v89.66,72.01 89.28,71.63 89.28,65.41 90.68,64.01 98.39,64.01 v98.42,63.98
N$15
  Top 0.254: C5.2 94.61,44.57 94.61,29.34 102.38,21.57 JP6.TIP
N$16
  Top 0.254: C5.1 R11.2
N$17  (1 unrouted)
  Top 0.254: U2.1 94.19,75.99 94.19,75.98 97.16,73.01 97.16,67.98 95.39,66.21 95.39,63.76 95.38,63.75 95.38,57.09 95.79,56.68
N$18  (via drill 0.6)
  other vias: 87.59,60.87
N$19
  Top 0.254: C24.1 58.29,78.89 R23.2 57.91,78.21 57.91,74.04 58.08,73.88 Y3.2 59.2,73.65 59.2,72.77 59.76,72.21 U$8.74
N$20  (via drill 0.5)
  Top 0.254: v5.84,54.74 5.84,52.23 U$1.4
  Bottom 0.254: R13.2 4.83,55.75 v5.84,54.74
N$22
  Top 0.254: 112.5,19.05 C29.1
  Top 0.61: D2.C 112.5,19.05
  Top 0.813: IC1.1 116.97,20.32 D2.C
N$23  (via drill 0.5)
  Top 0.254: U$1.30 14.21,61.48 16.76,58.93 v17.91,58.93
  Bottom 0.254: v17.91,58.93 17.91,57.17 17.42,57.17 HEART1.C
N$24  (via drill 0.5)
  Top 0.254: v15.37,63.63 15.37,65.36 U$1.29
  Bottom 0.254: HEART2.C 16.53,62.46 v15.37,63.63
N$25
  Bottom 0.254: HEART1.A R14.1
N$26
  Bottom 0.254: HEART2.A 11.12,61.14 R15.1
N$27  (1 unrouted)
  Top 0.254: U$8.63 65.26,72.53 65.02,72.77 65.02,75.31 65.15,75.44 66.09,75.44 | C22.1 65.91,78.38 R22.2 66.12,78.17 Y2.2
N$28
  Top 0.406: IC3.2 IC3.1 23.05,87.31 U$13.W+
  Bottom 0.254: U$13.W+ 28.7,90.3 31.5,87.5 44.2,87.5 49.02,92.33 49.02,96.9 50.04,97.92 58.42,97.92 59.31,97.03 59.31,95.12 JP4.5
N$29
  Top 0.406: IC3.6 IC3.7 30.61,85.72 34.8,89.92 U$13.R+
  Bottom 0.254: JP4.6 60.58,97.54 59.18,98.93 49.53,98.93 48.13,97.54 48.13,92.84 45.47,90.17 U$13.R+
N$30
  Top 0.406: C3.2 19.81,83.31 20.95,84.45 IC3.3
  Bottom 0.406: C3.2 18.54,79.5 16.89,81.15 16.89,84.58 R3.2
N$31
  Bottom 0.254: S2.- 4.44,19.05 1.52,21.97 1.52,32.23 R17.2
N$32
  Top 0.406: S2.NO 5.21,30.86 7.62,33.27 28.3,33.27 R20.1
N$33
  Top 0.254: 134.78,29.17 134.75,29.21
  Top 0.61: S3.0B 139.83,28.02 138.67,29.17 134.78,29.17
  Top 0.813: 12VIN.1 134.75,29.21 S3.0A
N$34
  Top 0.406: C4.2 31.24,79.5 28.32,82.42 28.32,83.12 IC3.5
  Bottom 0.406: C4.2 33.15,84.58 R21.2
N$35
  Top 0.254: 31.75,11.56 S4.3
  Top 0.406: R2.1 31.88,16.1 S4.3
N$36
  Top 0.254: U$1.1 2.21,47.58 R24.2
N$37
  Top 0.254: U$8.64 64.75,70.47 64.75,71.77 63.88,72.64 63.88,73.83 Y2.1 63.03,73.88 62.87,74.04 62.87,78.13 R22.1 63.09,80.62 C23.1
N$40  (via drill 0.6)
  other vias: 83.2,57.4
N$48
  Top 0.406: 123.57,80.26 123.57,77.72 123.44,77.6
N$50
  Top 0.406: 125.98,80.01 125.98,77.85 125.86,77.72
N$51
  Top 0.406: 128.52,80.14 128.52,77.85 128.65,77.72
N$52
  Top 0.406: 131.06,80.14 131.06,77.85 131.19,77.72
N$55
  Top 0.406: 123.95,73.28 123.95,70.87 123.82,70.74
N$60
  Top 0.406: 126.49,73.15 126.49,70.74
N$61
  Top 0.406: 129.03,73.28 129.03,70.74
N$62
  Top 0.406: 131.57,73.28 131.57,70.74
N$63
  Top 0.406: 134.11,73.28 134.11,70.74
N$64
  Top 0.406: 136.65,73.28 136.65,70.74
N$65
  Top 0.406: 133.99,80.26 133.99,77.85
N$66
  Top 0.406: 136.53,80.26 136.53,77.85
N$67
  Top 0.254: 68.77,54.63 68.77,52.8 70.66,50.91 73.9,50.91
N$68  (via drill 0.5)
  other vias: 73.87,50.9
N$70
  Top 0.254: 69.26,55.08 69.26,53.29 69.27,53.29
N$71  (via drill 0.5)
  Top 0.254: 57.02,60.33 51.82,60.33 v51.05,61.09
N$72  (via drill 0.5)
  Top 0.254: 56.9,59.82 50.67,59.82 v49.78,60.71
N$74  (via drill 0.5)
  Top 0.254: 70.87,54.1 73.79,54.1 v74.93,55.24
N$75  (via drill 0.5)
  Top 0.254: 70.74,53.47 74.55,53.47 75.31,54.23 v75.56,54.23
N$76  (via drill 0.5)
  Top 0.254: v75.44,52.96 70.48,52.96 70.48,52.97 69.8,53.65
N$77  (via drill 0.5)
  Top 0.254: v74.04,52.07 70.47,52.07 69.27,53.27
N$78
  Top 0.254: C26.1 60.83,78.59 R23.1 61.17,77.79 Y3.1 61.01,75.31 60.2,75.31 60.07,75.18 60.07,72.77 60.26,72.58 U$8.73
N$82
  Top 0.254: 69.78,55.2 69.78,53.67 69.83,53.62
N$83
  Top 0.254: 70.25,54.91 70.25,53.93 70.72,53.47
N$84
  Top 0.254: 70.77,54.76 70.77,54.21 70.88,54.1
N$85
  Top 0.254: 84.71,60.35 87.58,57.48
N$86  (via drill 0.6)
  other vias: 87.59,57.49
N$87  (via drill 0.5)
  other vias: 32.02,62.88
N$89  (via drill 0.5)
  other vias: 23.86,60.59
N$90  (via drill 0.5)
  other vias: 23.82,59.33
N$95
  Top 0.254: 73.54,67.83 74.73,67.83 76.45,69.56
N$96  (via drill 0.5)
  other vias: 76.47,69.58
N$97
  Top 0.254: HEART.A 72.23,48.16 68.26,52.13 U$8.19
N$98
  Top 0.254: R30.2 72.35,40.87 HEART.C
RB6
  Top 0.254: U$8.26 76.6,56.84 76.82,56.61 76.82,52.07 | 76.82,52.07 76.82,51.79 | X1.5 83.06,17.14 80.9,19.3 80.9,29.46 76.83,33.53 76.83,52.05 76.82,52.07
RB7
  Top 0.254: U$8.27 77.11,57.34 77.84,56.61 77.84,33.92 82.04,29.72 82.04,19.81 X1.4
RE2
  Top 0.254: R20.2 28.32,37.59 33.02,42.29 33.02,56.9 33.96,57.84 U$8.98
RELAY  (via drill 0.5)
  Top 0.254: U$8.39 76.42,63.34 v77.34,64.26 | v107.95,60.46 110.62,60.45 113.41,63.25 JP5.2
  Bottom 0.254: v77.34,64.26 87.25,64.26 91.06,60.45 v107.95,60.46
RIGHT_BT  (via drill 0.5)
  Top 0.254: U$1.39 3.41,70.47 3.81,70.87 36.83,70.87 v36.96,70.99 | v38.73,75.56 39.75,75.56 39.88,75.44 39.88,74.27 U$15.10
  Bottom 0.254: v36.96,70.99 38.23,72.26 38.23,75.06 v38.73,75.56
RIGHT_CODEC  (via drill 0.5)
  Top 0.254: U$15.8 40.89,77.85 v41.4,78.36 | v84.71,72.14 84.84,72.26 84.84,74.41 U2.39
  Bottom 0.254: v41.4,78.36 66.67,78.36 70.23,74.8 70.23,73.91 72.01,72.14 v84.71,72.14
SDCD  (via drill 0.5)
  Top 0.254: U1.CD R9.1 58.7,36.7 58.8,36.7 v59.94,37.85 | U$8.7 62.26,52.1 60.83,50.67 60.83,44.07 v61.72,43.18
  Bottom 0.254: v61.72,43.18 61.72,37.97 61.6,37.85 v59.94,37.85
SDCLK  (via drill 0.5)
  Top 0.254: U$8.10 63.76,50.67 63.1,50.01 63.09,50.01 62.1,49.02 62.1,45.85 v61.85,45.59 | v54.36,35.81 54.36,34.08 U1.5
  Bottom 0.254: v61.85,45.59 54.99,45.59 54.36,44.96 v54.36,35.81
SDCS
  Top 0.254: U1.1 64.05,35.57 R7.1 64.8,36.32 66.04,36.32 67.06,37.34 67.06,41.53 66.67,41.91 61.34,41.91 60.33,42.93 60.33,51.05 61.76,52.49 U$8.6
SDI  (via drill 0.5)
  Top 0.254: R8.1 61.55,36.25 U1.2 61.85,33.46 v61.85,30.99 | U$8.12 64.76,46.35 v64.01,45.59
  Bottom 0.254: v64.01,45.59 64.01,33.15 v61.85,30.99
SDO  (via drill 0.5, 0.6)
  Top 0.254: U1.7 49.15,33.77 R6.1 49.3,36.58 v51.05,36.58 | U$8.11 64.26,48.77 v63.63,48.13
  Bottom 0.254: v63.63,48.13 51.69,48.13 51.05,47.5 v51.05,36.58
SDWP  (via drill 0.5)
  Top 0.254: U1.WP 44.28,36.38 R10.1 42.06,36.55 v40.64,37.97 | U$8.8 62.76,50.95 v61.85,50.04
  Bottom 0.254: v61.85,50.04 52.04,50.04 49.89,47.89 | 49.9,47.89 49.89,47.89 | 49.89,47.89 49.44,47.45 46.54,44.54 43.21,41.22 43.2,41.22 40.64,38.66 v40.64,37.97
TO_RX  (via drill 0.5)
  Top 0.254: U$8.51 71.26,72.91 72.26,73.91 v72.26,75.06 | v20.07,53.72 20.07,52.35 U$1.16
  Bottom 0.254: v72.26,75.06 67.44,79.88 36.7,79.88 34.54,77.72 19.94,77.72 17.91,75.69 17.91,69.22 20.07,67.06 v20.07,53.72
TO_TX  (via drill 0.5)
  Top 0.254: U$8.52 70.76,73.56 v71.37,74.17 | 19.05,52.16 U$1.15 18.8,51.99 18.8,50.67 v19.05,50.42
  Bottom 0.254: v71.37,74.17 71.37,74.55 66.67,79.25 36.96,79.25 34.67,76.96 20.07,76.96 18.8,75.69 18.8,69.72 20.95,67.56 20.95,51.05 20.32,50.42 v19.05,50.42
VCC  (via drill 0.5, 0.6, 0.7)
  Top 0.254: 36.83,39.37 31.75,34.29 R2.2 25.23,18.95 R19.1 | 36.83,39.37 44.43,39.37 R10.2 49.02,39.4 R6.2 56.52,39.27 | 56.52,39.27 58.42,39.27 | 58.8,38.99 58.52,39.27 58.42,39.27 | R9.2 R8.2 R7.2 | U1.4 56.55,39.24 56.52,39.27 | 59.76,53.34 59.76,52.51 59.42,52.17 59.42,40.27 R9.2 | U$8.37 72.86,62.36 v70.74,62.36 70.87,62.48 70.87,66.29 | U$8.30 72.92,58.8 73.79,58.8 73.91,58.67 73.91,58.42 73.83,58.34 U$8.29 69.13,58.34 v68.06,59.41 66.76,58.11 U$8.16 | R7.2 64.77,40.51 64.26,41.02 59.44,41.02 | 58.42,39.27 R9.2 | 70.87,66.29 70.87,66.67 71.03,66.84 U$8.46 74.53,66.83 75.07,67.38 79.24,67.38 80.31,66.31 80.96,65.66 C9.1 | R7.2 57.89,39.14 57.79,39.24 56.52,39.24 56.52,25.78 v57.28,25.02 | v76.07,22.35 79.5,22.35 | 79.5,22.35 79.63,22.23 X1.2 | U2.45 87.88,74.46 87.88,75.44 87.76,75.56 86.99,75.56 86.86,75.43 U2.43 86.86,71.42 86.44,70.99 84.07,70.99 83.64,71.42 83.64,72.4 84.36,73.12 U2.38 | U$8.62 65.76,66.44 | 65.76,66.44 65.91,66.29 70.87,66.29 | 65.76,66.44 65.76,64.49 65.53,64.26 59.18,64.26 | v60.45,53.34 59.76,53.34 | 59.76,53.34 U$8.2 | 59.18,64.26 59.18,63.84 U$8.86 | U$8.16 | U$8.16 66.76,54.14 67.47,53.44 v67.47,53.34 | U$8.85 59.11,64.34 59.18,64.26 | C1.1 24.36,54.81 24.15,54.6 U$1.17 23.5,54.6 23.51,54.59 23.51,56.78 | 23.51,56.78 23.28,57 U$1.19 U$1.20 | 36.83,39.37 36.83,50.01 v34.31,52.52 | v25.45,56.94 23.67,56.94 23.51,56.78 | 79.5,22.35 79.5,25.82 v79.49,25.83 | v86.59,33.72 v86.59,39.26 | U2.38 | U2.38 84.36,73.12 83.65,72.4 83.65,71.41 84.04,71.01 84.04,65.64 84.02,65.61 | 81.04,81 81.05,80.99 U2.26 79.93,80.99 79.43,81.5 77.38,81.5 v77.19,81.31 | U2.32 80.91,77.99 80.25,77.33 77.53,77.33 77.28,77.58 77.28,81.22 v77.19,81.31
  Top 0.254: U2.14 88.86,81.5 v88.76,81.39 88.52,81.15 88.52,78.56 88.95,78.13 89.59,78.13 89.94,78.49 U2.6 | v86.36,81.5 U2.19 | C15.1 94.11,73.48 v92.93,74.66 | v77.19,81.31 77.19,81.29
  Top 0.406: v121.79,57.4 C16.+ | v121.79,61.72 121.79,76.2 118.99,78.99 | JP3.8 80.01,94.49 93.34,94.49 96.88,90.96 96.88,85.25 100.98,81.15 C18.+ 116.84,81.15 118.99,78.99 | 119,78.99 118.99,78.99 | C19.1 95.38,71.12 C15.1
  Top 0.61: IC2.3 116.97,36.32 109.39,28.74 109.39,22.95 C32.1 | v106.06,62.09 106.67,61.47 106.67,55.55 107.64,54.59 107.65,54.59 109.05,53.19 121.77,53.19 C16.+ | v87.46,65.61 84.02,65.61 82.34,65.61 C9.1
  Bottom 0.254: C8.1 68.19,63.47 C25.1 | C8.1 68.19,61.31 67.17,60.3 | 67.17,60.3 C20.1 65.9,59.04 67.18,60.33 | v68.06,59.41 67.17,60.3 | C8.1 70.71,62.33 v70.74,62.36 | v57.28,25.02 59.94,22.35 v76.07,22.35 | v60.45,53.34 v67.47,53.34 | v34.31,52.52 29.87,52.52 v25.45,56.94 | C11.1 87.78,41.66 R18.2 87.09,39.27 | 87.09,39.27 86.6,39.27 v86.59,39.26 87.08,39.26 87.09,39.27 | v79.49,25.83 79.49,26.62 v86.59,33.72 | v92.93,74.66 92.93,81.79 | 92.93,81.79 93.79,82.65 111.4,82.65 C18.+ | 92.93,81.79 89.15,81.79 v88.76,81.39 86.46,81.39 v86.36,81.5 77.38,81.5 v77.19,81.31
  Bottom 0.406: JP3.8 78.23,98.42 77.98,98.68 63.63,98.68 63.12,98.17 JP4.8 | v121.79,61.72 v121.79,57.4
  Bottom 0.61: v106.06,62.09 90.98,62.09 87.68,65.39 v87.46,65.61
  Bottom 0.813: C16.+ 121.79,47.62 116.97,42.8 IC2.3
VDD  (via drill 0.5, 0.7)  (1 unrouted)
  Top 0.254: 12.95,18.92 S2.+ | 104.52,2.29 104.65,2.16 | U$2.3 26.84,2.42 26.71,2.29 | IC3.8 27.27,87 | U$15.1 36.51,70.02 35.04,68.56 30.93,68.56 C7.1 30.92,69.68 30.46,70.14 11.84,70.14 v10.95,69.26
  Top 0.406: C21.1 124.97,3.43 | 27.27,87 26.27,85.99 26.27,74.68 25.54,73.96 v11.26,73.96 | LED3.A 108.01,2.21 107.96,2.16
  Top 0.61: 12.95,18.92 12.95,13.97 24.64,2.29 26.71,2.29 103.53,2.29 | 103.53,2.29 104.52,2.29 | v110.76,21.08 110.52,21.08 C31.1 | C30.1 110.49,13.84 v110.76,14.11 | 124.97,3.43 124.97,3.29 123.98,2.3 103.54,2.3 103.53,2.29
  Top 0.813: C21.1 124.97,10.66 DC1.1 122.17,29.08 IC1.3
  Bottom 0.254: v10.95,69.26 8.27,69.26 8.23,69.21 | v110.76,21.08
  Bottom 0.406: S2.+ 9.86,22.02 9.86,40.45 8.23,42.07 R14.2 R15.2 8.23,69.21 8.23,72.1 10.1,73.97 v11.25,73.97 v11.26,73.96
  Bottom 0.61: v110.76,14.11 v110.76,21.08 111.63,21.95 111.63,25.4 119.05,25.4 122.17,28.52 122.17,29.08 IC1.3
  Bottom 0.813: IC1.3 IC2.1
VFDBLANK
  Top 0.254: U$8.57 68.26,89.47 71.88,93.09 71.88,95 JP3.4
VFDCLOCK  (via drill 0.5)
  Top 0.254: U$8.38 78.2,62.84 78.74,63.37 v78.74,66.42 | v78.74,70.36 78.74,75.06 78.49,75.31 76.45,75.31 75.82,75.95 75.82,90.17 74.42,91.57 74.42,97.03 73.66,97.79 72.14,97.79 JP3.2
  Bottom 0.254: v78.74,66.42 v78.74,70.36
VFDDATA
  Top 0.254: U$8.58 67.76,90.88 JP3.1
VFDLATCH
  Top 0.254: U$8.49 74.43,68.34 74.8,68.71 74.8,89.66 73.15,91.31 JP3.3
VPP
  Top 0.813: S3.1A D2.A
  Bottom 0.61: S3.1B S3.1A

### Text on the board
tNames: 8 | 8 | 1 | 1 | * | (_( / ('') / _ "\ )>,_ .--> / _>--w/((_ >,_.' / /// / "`" | * | gnd | * | KEJIAN LIN FTW | sig | * | 3.3v | led- | led+
bNames: MY LIFE FOR AUIR | ECE477 Purdue F2015 Team8 / Ran An, Kejian Lin / Yixing Liu, Zhiyi Xiang / Proudly Presents